# EAGLE board FDT_BIG_Jly21 (EAGLE 7.6.0), part 1 of 3
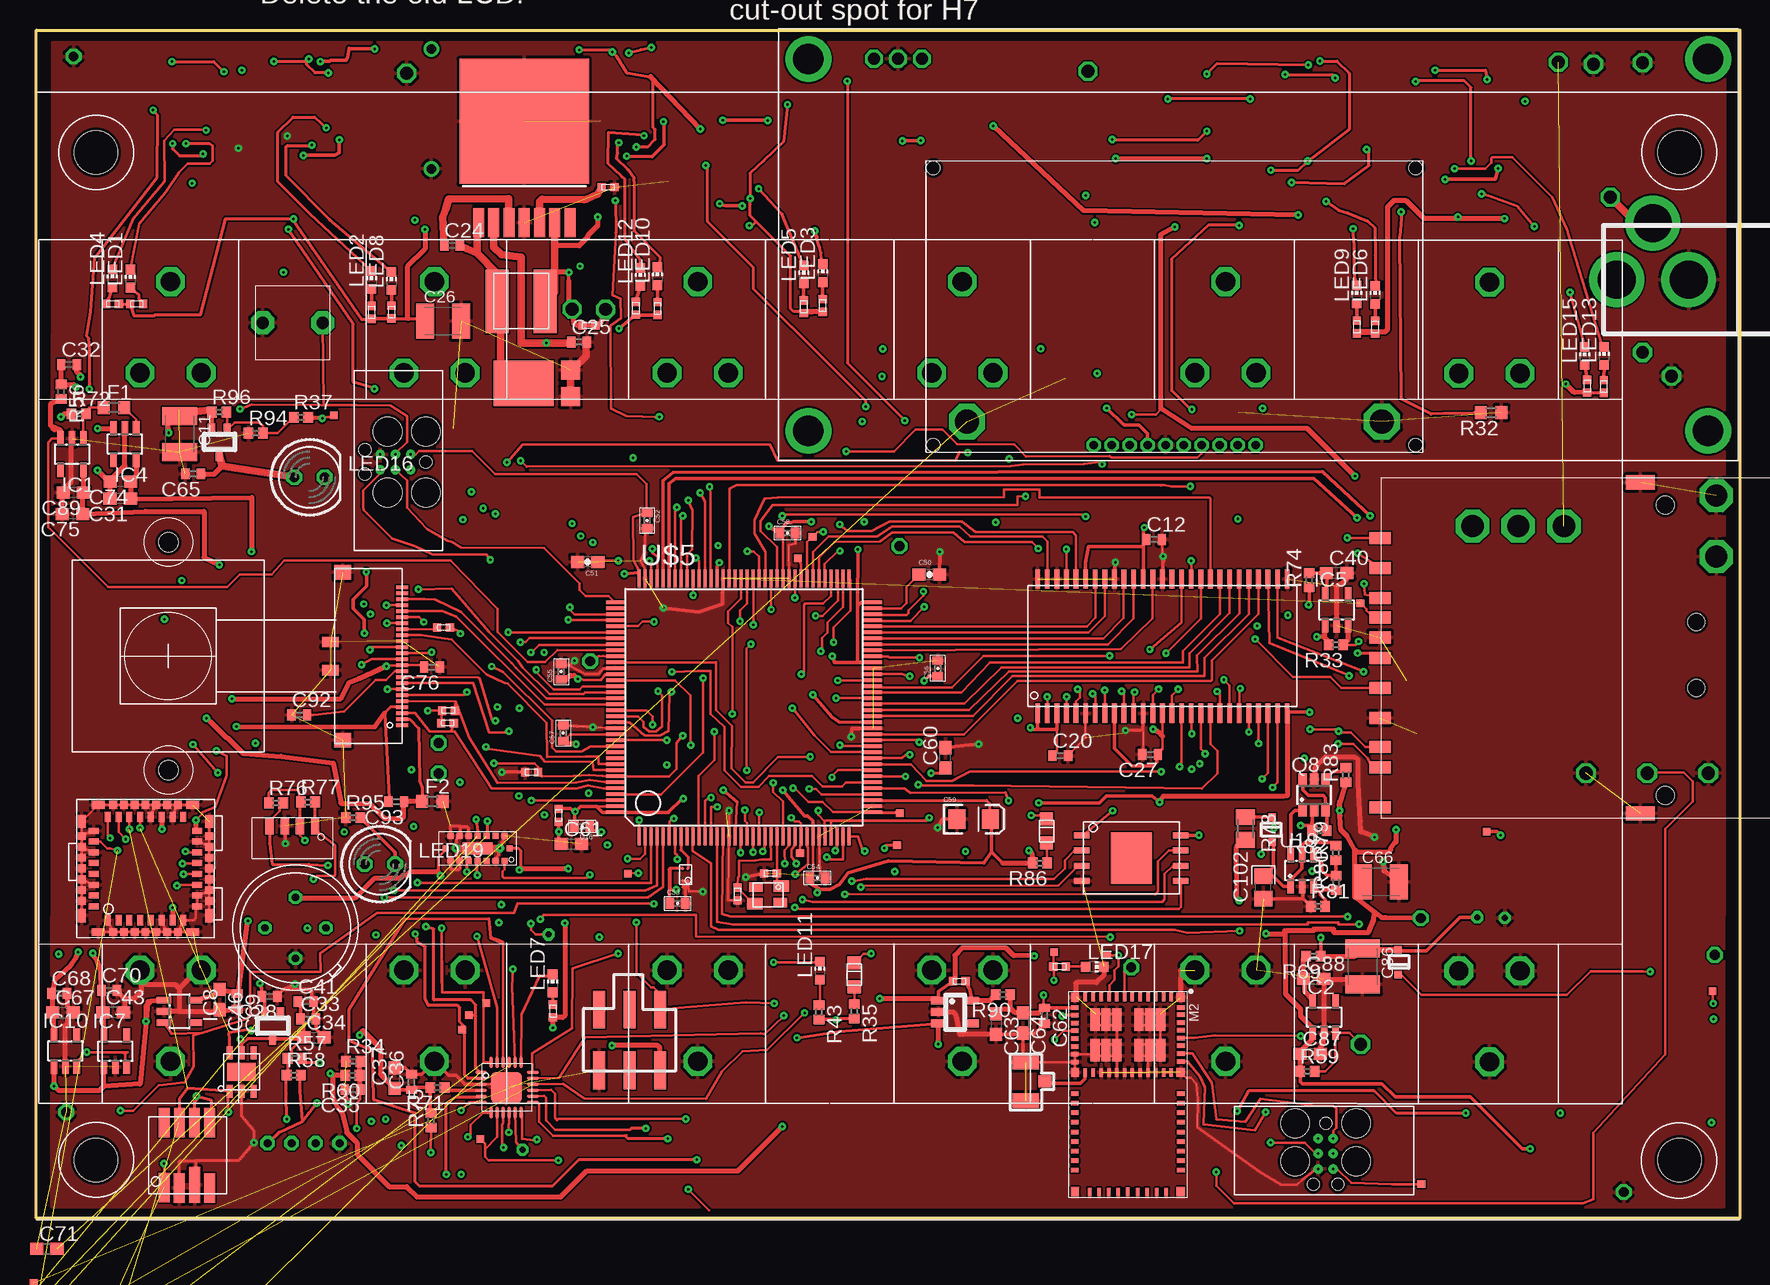
[diagram p7: board, top side]
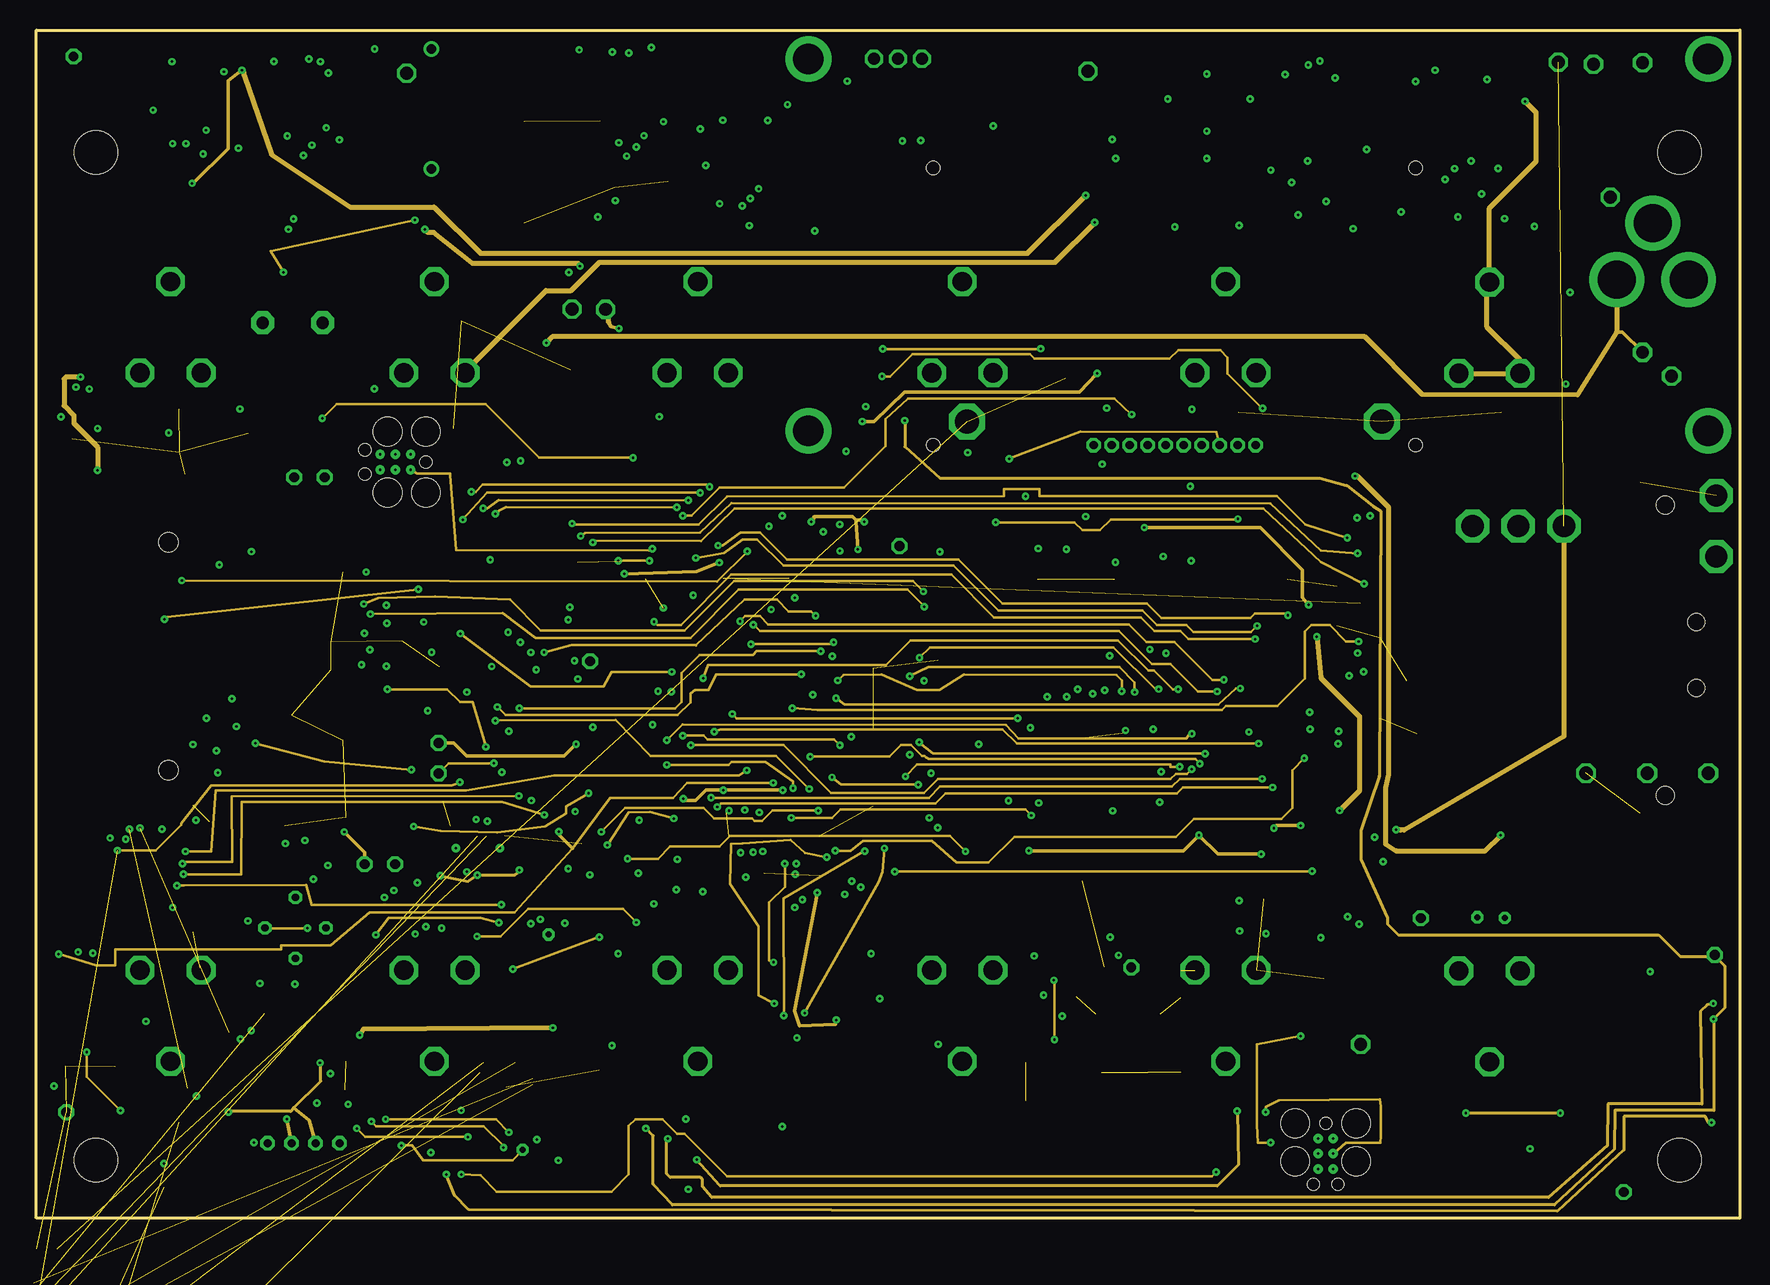
[diagram p8: board, inner layer Route2]
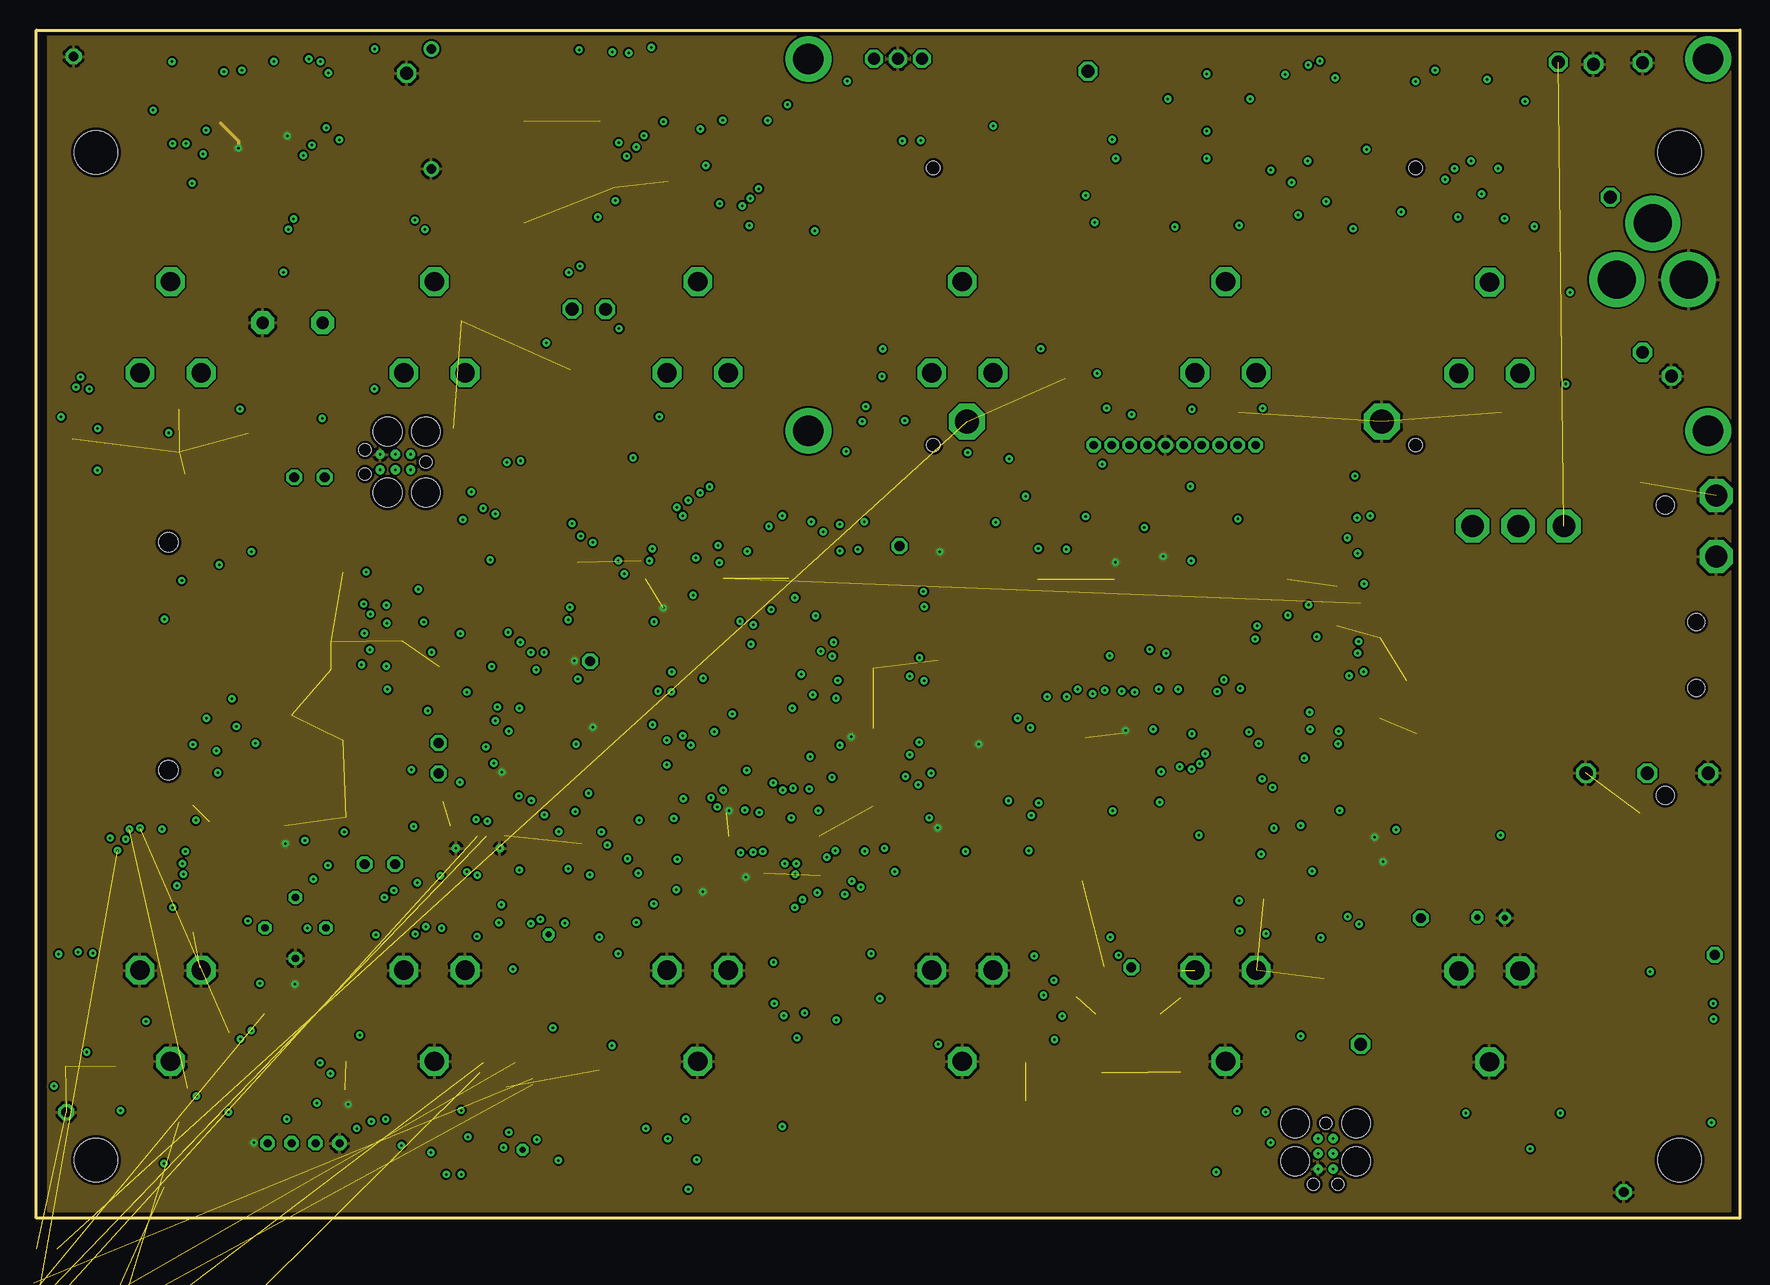
[diagram p9: board, inner layer Route15]
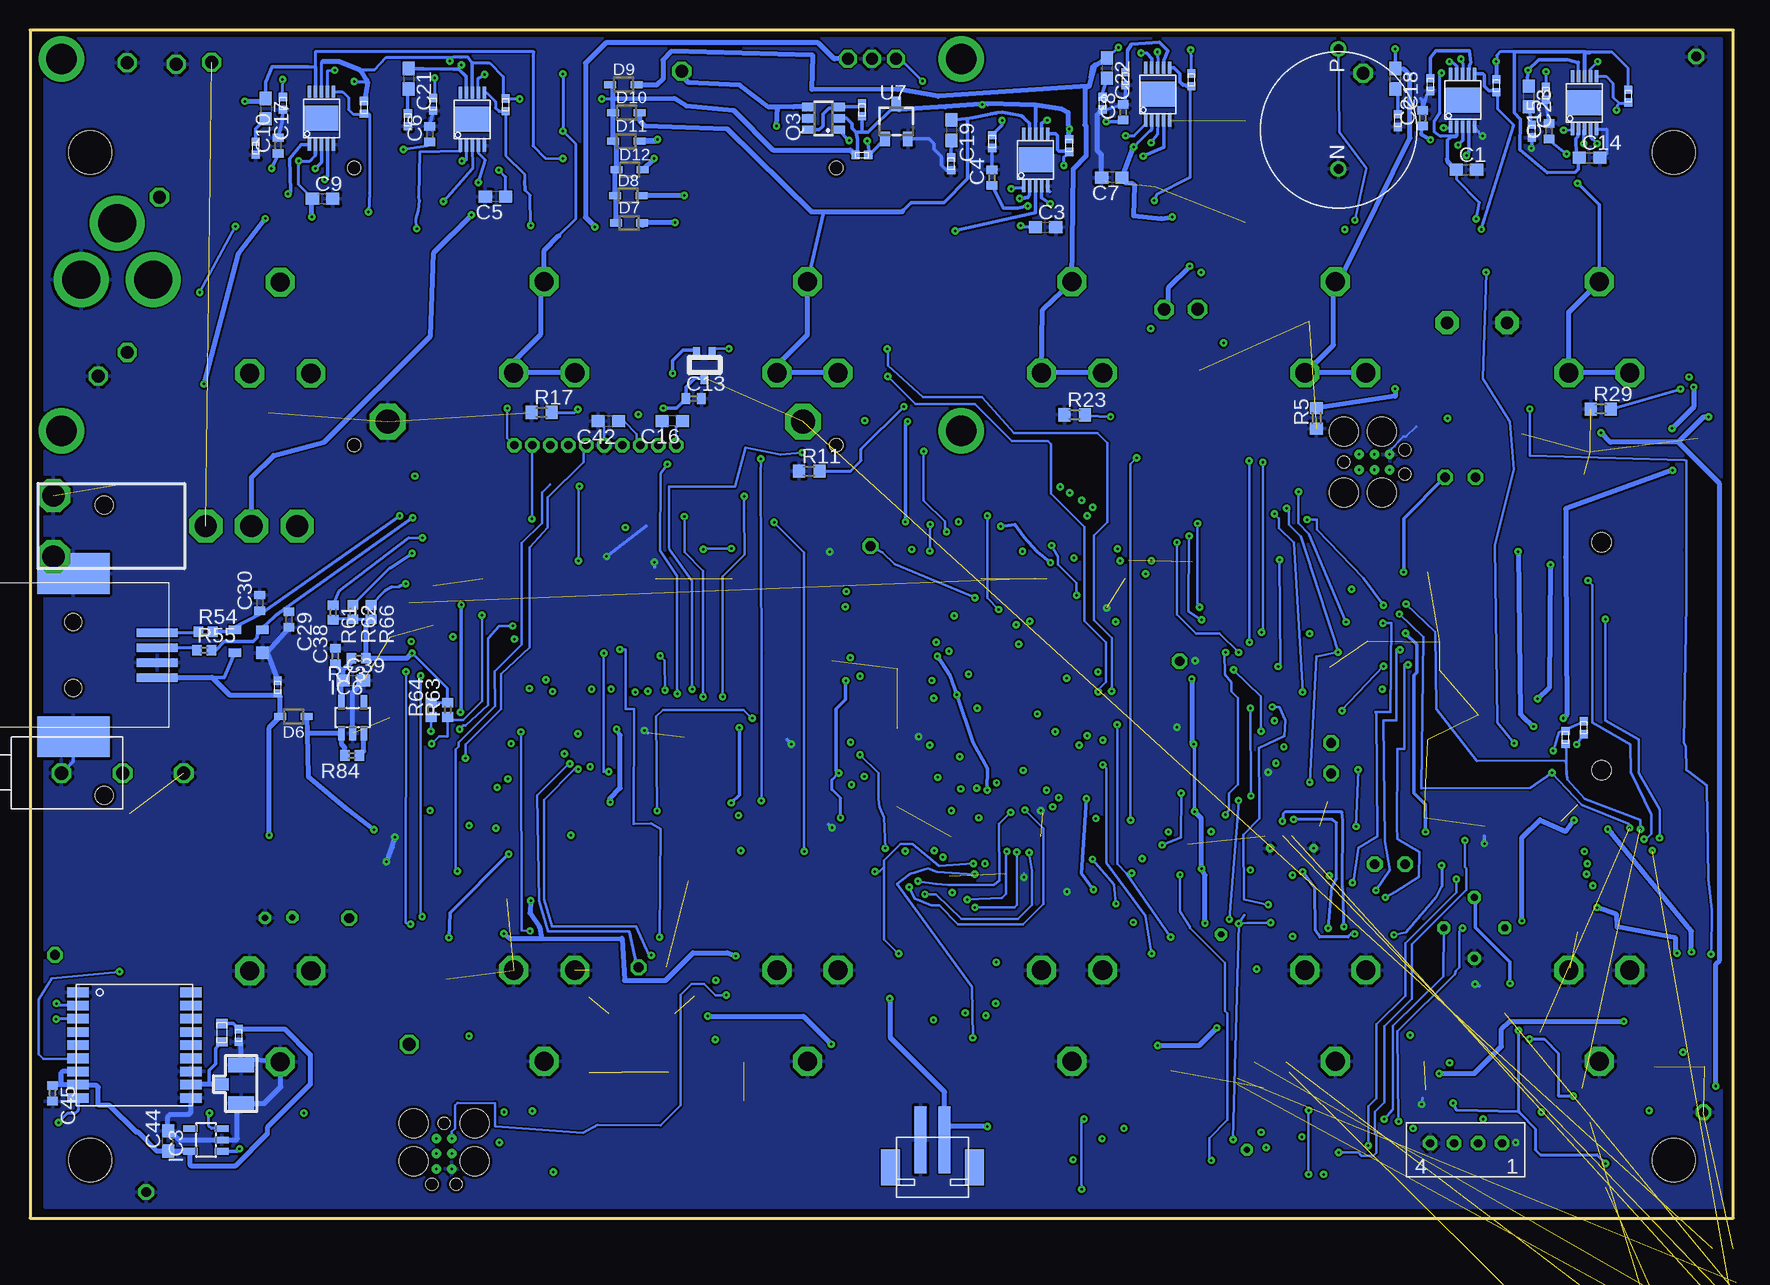
[diagram p10: board, bottom side, seen from below]

Size 141.99 x 99.06 mm. Coordinates in mm from the lower left corner, seen from the top.
Outline: 0,0 0,99.06 141.99,99.06 141.99,0 0,0
Copper layers (1*2*15*16): Top 0.035mm / dielectric 1.5mm / Route2 0.035mm / dielectric 0.15mm / Route15 0.035mm / dielectric 0.2mm / Bottom 0.035mm
Design rules "default *": minimum track width 6mil, minimum drill 8mil, track to track 6mil, track to pad 6mil, pad to pad 6mil, via to via 6mil, smd to smd 6mil, copper to edge 10mil, drill to drill 8mil, minimum pad ring 10mil, minimum via ring 8mil, stop-mask expansion 4mil, vias tented up to drill 0mil, thermal gap 10mil

## Footprints (pad centres in the part's own frame; a part is rotated, then mirrored left to right if it is on the bottom)
BATT_COIN_BR1225 = drill 0.8: NEG 0,0; PLUS 10,0
BATT_HALFX6 = drill 1.6 octagon: 1NA -53.35,-28.19; 1NB -48.25,-28.19; 1NC -50.8,-35.79; 1PA -50.8,29.21; 1PB -53.35,21.61; 1PC -48.25,21.61; 2NA -28.8,-35.79; 2NB -31.35,-28.19; 2NC -26.25,-28.19; 2PA -28.8,29.21; 2PB -31.35,21.61; 2PC -26.25,21.61; 3NA -9.4,-28.19; 3NB -4.3,-28.19; 3NC -6.85,-35.79; 3PA -6.85,29.21; 3PB -9.4,21.61; 3PC -4.3,21.61; 4NA 12.65,-28.19; 4NB 17.75,-28.19; 4NC 15.2,-35.79; 4PA 15.2,29.21; 4PB 12.65,21.61; 4PC 17.75,21.61; 5NA 34.6,-28.19; 5NB 39.7,-28.19; 5NC 37.15,-35.79; 5PA 37.15,29.21; 5PB 34.6,21.61; 5PC 39.7,21.61; 6NA 56.6,-28.24; 6NB 61.7,-28.24; 6NC 59.15,-35.84; 6PA 59.15,29.16; 6PB 56.6,21.56; 6PC 61.7,21.56
ENCL_1554H = hole 3.6: -66,42; 66,42; 66,-42; -66,-42
C0603 = smd 1.1 x 1: 1 -0.85,0; 2 0.85,0
C0402 = smd 0.7 x 0.9: 1 -0.65,0; 2 0.65,0
C1210K = smd 1.5 x 2.9: 1 -1.5,0; 2 1.5,0
SMD_0402 = smd 0.686 x 0.686: P$1 -0.533,0; P$2 0.533,0
0603-CAP = smd 1.1 x 1: 1 -0.85,0; 2 0.85,0
0402-CAP = smd 0.7 x 0.9: 1 -0.65,0; 2 0.65,0
EIA3216 = smd 1.4 x 1.6: A 1.4,0; C -1.4,0
C0805ELEC = smd 1.3 x 1.5: 1P 0.95,0; 2N -0.95,0
DIODE_BIG = smd 1.6 x 1.6: 1_A -1.1,-3.9; 2_A 1.1,-3.9 | smd 3.8 x 5: 3_K 0,0
TVSDIODE = smd 1.05 x 1.05: P$1 0,0 | smd 0.7 x 1.05: P$2 1.92,0; P$3 1.92,2.3; P$4 0,2.3
SOD323 = smd 0.625 x 0.625: A -1.1,0; K 1,0
SOD323' = smd 1 x 0.6: 1_K -1.1,0; 2_A 1.1,0
R0603 = smd 1 x 1.1: 1 -0.85,0; 2 0.85,0
GPS_ANTE = smd 2.2 x 1.2: P$1 0,-1.6; P$2 0,1.6 | smd 1.1 x 1: P$3 1.6,0
IND_CDRH4D = smd 5.3 x 1.9: P$3 0,2; P$4 0,-2
SOT23-5 = smd 0.55 x 1.2: 1 -0.95,-1.3; 2 0,-1.3; 3 0.95,-1.3; 4 0.95,1.3; 5 -0.95,1.3
FLIR_SOCKET = smd 0.5 x 0.84: P$1 -3.15,-4.31; P$2 -2.25,-4.31; P$3 -1.35,-4.31; P$4 -0.45,-4.31; P$5 0.45,-4.31; P$6 1.35,-4.31; P$7 2.25,-4.31; P$8 3.15,-4.31; P$17 3.15,4.31; P$18 2.25,4.31; P$19 1.35,4.31; P$20 0.45,4.31; P$21 -0.45,4.31; P$22 -1.35,4.31; P$23 -2.25,4.31; P$24 -3.15,4.31 | smd 0.84 x 0.5: P$9 4.31,-3.15; P$10 4.31,-2.25; P$11 4.31,-1.35; P$12 4.31,-0.45; P$13 4.31,0.45; P$14 4.31,1.35; P$15 4.31,2.25; P$16 4.31,3.15; P$25 -4.31,3.15; P$26 -4.31,2.25; P$27 -4.31,1.35; P$28 -4.31,0.45; P$29 -4.31,-0.45; P$30 -4.31,-1.35; P$31 -4.31,-2.25; P$32 -4.31,-3.15 | smd 1.1 x 0.65: P$33 -3.93,-5.3; P$41 3.93,-5.3; P$51 3.93,5.3; P$59 -3.93,5.3 | smd 0.65 x 0.65: P$34 -2.7,-5.3; P$35 -1.8,-5.3; P$36 -0.9,-5.3; P$37 0,-5.3; P$38 0.9,-5.3; P$39 1.8,-5.3; P$40 2.7,-5.3; P$43 5.3,-2.7; P$44 5.3,-1.8; P$45 5.3,-0.9; P$46 5.3,0; P$47 5.3,0.9; P$48 5.3,1.8; P$49 5.3,2.7; P$52 2.7,5.3; P$53 1.8,5.3; P$54 0.9,5.3; P$55 0,5.3; P$56 -0.9,5.3; P$57 -1.8,5.3; P$58 -2.7,5.3; P$61 -5.3,2.7; P$62 -5.3,1.8; P$63 -5.3,0.9; P$64 -5.3,0; P$65 -5.3,-0.9; P$66 -5.3,-1.8; P$67 -5.3,-2.7 | smd 0.65 x 1.1: P$42 5.3,-3.93; P$50 5.3,3.93; P$60 -5.3,3.93; P$68 -5.3,-3.93
CONN_FPC_24PIN = smd 0.3 x 1: P1 5.75,0.5; P2 5.25,0.5; P3 4.75,0.5; P4 4.25,0.5; P5 3.75,0.5; P6 3.25,0.5; P7 2.75,0.5; P8 2.25,0.5; P9 1.75,0.5; P10 1.25,0.5; P11 0.75,0.5; P12 0.25,0.5; P13 -0.25,0.5; P14 -0.75,0.5; P15 -1.25,0.5; P16 -1.75,0.5; P17 -2.25,0.5; P18 -2.75,0.5; P19 -3.25,0.5; P20 -3.75,0.5; P21 -4.25,0.5; P22 -4.75,0.5; P23 -5.25,0.5; P24 -5.75,0.5 | smd 0.85 x 1.4: P$25 -1.175,-5.46; P$26 1.175,-5.46 | smd 1.22 x 1.4: P$27 -7,-4.45; P$28 7,-4.45
USB_B_SMT_HORIZ = smd 0.7 x 3.4: 1_VBUS 1.875,7; 2_DM -0.625,7; 3_DP -1.875,7; 4_GND 0.625,7 | smd 3.4 x 6.04: P$1 6.8,0; P$2 -6.8,0 | hole 1.4: -2.75,0; 2.75,0
HDR_SEGGER_6P = drill 0.203 pad 0.787: 1_VREF 1.27,-0.635; 2_DIO 1.27,0.635; 3_RST 2.54,-0.635; 4_CLK 2.54,0.635; 5_GND 3.81,-0.635; 6_SWO 3.81,0.635 | hole 0.991: 0,0; 5.08,-1.016; 5.08,1.016 | hole 2.388: 0,2.54; 0,-2.54; 3.175,2.54; 3.175,-2.54
HDR_PGM_TINY_SMT = smd 3.15 x 1: 1_VCC -2.54,-2.54; 2_RST_PGM 2.54,-2.54; 3__NC -2.54,0; 4__NC 2.54,0; 5__GND -2.54,2.54; 6__NC 2.54,2.54
CONN_4PCABLE = drill 0.7 octagon: P1 6,0; P2 4,0; P3 2,0; P4 0,0
CONN_2PCABLE_SMT = smd 1 x 5.6: P$1 -1,-2.8; P$2 1,-2.8 | smd 1.6 x 3: P$3 -3.5,-0.5; P$4 3.5,-0.5
PWR_JAC4 = drill 3.175 pad 4.572: P$1 0,5.994; P$2 0,0; P$3 4.699,2.997
SMD_IND = smd 0.762 x 0.94: P$1 -0.762,0; P$2 0.762,0
LCD_NHD_3PINS = drill 1 octagon: 1_D -29.5,15.5; 2_VSS -27.5,15.5; 3_VDD -25.5,15.5 | drill 2.54 pad 3.81: P$1 -34.96,-15.5; P$2 -34.96,15.5; P$3 40.04,15.5; P$4 40.04,-15.5
CHIP-LED0603 = smd 0.8 x 0.8: A 0,-0.75; C 0,0.75
LED_RA_SM = smd 1.1 x 1.1: 1_A -1,0; 2_K 1,0
LED5MM = drill 0.813 octagon: A -1.27,0; K 1.27,0
LENS_MOUNT_CMT107 = hole 1.6: -9.5,0; 9.5,0
ISP4520-LGA-QFN74-9.8X17.2X1.7MM = smd 0.7 x 0.7: 1 0.5,9.3; 14 0.5,0.5; 23 6.75,0.5; 36 6.75,9.3; 54 16.7,0.5; 64 16.7,9.3 | smd 0.65 x 0.3: 2 0.475,8.525; 3 0.475,7.875; 4 0.475,7.225; 5 0.475,6.575; 6 0.475,5.925; 7 0.475,5.275; 8 0.475,4.625; 9 0.475,3.975; 10 0.475,3.325; 11 0.475,2.675; 12 0.475,2.025; 13 0.475,1.325; 24 6.775,1.325; 25 6.775,2.025; 26 6.775,2.675; 27 6.775,3.325; 28 6.775,3.975; 29 6.775,4.625; 30 6.775,5.275; 31 6.775,5.925; 32 6.775,6.575; 33 6.775,7.225; 34 6.775,7.875; 35 6.775,8.525; 55 16.73,1.7; 56 16.73,2.5; 57 16.73,3.3; 58 16.73,4.1; 59 16.725,4.9; 60 16.73,5.7; 61 16.73,6.5; 62 16.73,7.3; 63 16.73,8.1 | smd 0.3 x 0.65: 15 1.35,0.475; 16 2,0.475; 17 2.65,0.475; 18 3.3,0.475; 19 3.95,0.475; 20 4.6,0.475; 21 5.25,0.475; 22 5.9,0.475; 37 5.85,9.325; 38 5.2,9.325; 39 4.55,9.325; 40 3.9,9.325; 41 3.25,9.325; 42 2.6,9.325; 43 1.95,9.325; 44 1.35,9.325; 45 8.525,0.475; 46 9.325,0.475; 47 10.125,0.475; 48 10.925,0.475; 49 11.725,0.475; 50 12.525,0.475; 51 13.325,0.475; 52 14.125,0.475; 53 14.925,0.475; 65 14.925,9.325; 66 14.125,9.325; 67 13.325,9.325; 68 12.525,9.325; 69 11.725,9.325; 70 10.925,9.325; 71 10.125,9.325; 72 9.325,9.325; 73 8.525,9.325 | smd 0.85 x 0.8: 74 1.88,5.825; 75 4.425,5.825; 76 1.88,2.175; 77 4.425,2.175; 78 1.88,6.725; 79 1.88,7.625; 80 2.83,5.825; 81 2.83,6.725; 82 2.83,7.625; 83 4.43,6.725; 84 4.43,7.625; 85 5.38,5.825; 86 5.38,6.725; 87 5.38,7.625; 88 1.88,3.075; 89 1.88,3.975; 90 2.83,2.175; 91 2.83,3.075; 92 2.83,3.975; 93 4.43,3.075; 94 4.43,3.975; 95 5.38,2.175; 96 5.38,3.075; 97 5.38,3.975
PIR_4P = drill 0.61 pad 0.864 octagon: DL 2.54,0; SI -2.54,0; VDD 0,2.54; VSS 0,-2.54
SOT23_PFET = smd 0.6 x 1: 1_G 0.65,0.83; 2_S -0.65,0.83; 3_D 0,-1.27
SSOT6 = smd 0.69 x 0.99: 1 -0.95,-1.3; 2 0,-1.3; 3 0.95,-1.3; 4 0.95,1.3; 5 0,1.3; 6 -0.95,1.3
R0402 = smd 0.8 x 0.9: 1 -0.6,0; 2 0.6,0
M0805 = smd 1.3 x 1.6: 1 -0.95,0; 2 0.95,0
SD_CARD = smd 1 x 1.8: CD 2.725,0; P1 6.875,0; P2 4.375,0; P3 1.075,0; P4 -0.625,0; P5 -3.125,0; P6 -5.625,0; P7 -8.05,0; P8 -9.75,0; P9 9.375,0; WP -13.1,0 | smd 1.2 x 2.4: P$12 -13.6,-21.7; P$13 14,-21.7 | hole 1.5: -12.1,-23.8; 12.1,-23.8
SW_SQ = drill 1.016 pad 1.93 octagon: P$1 -2.5,0; P$2 2.5,0
SW_TOG_RA = drill 1.854 octagon: P$1 0,0; P$2 3.81,0; P$3 7.62,0; P$4 -12.7,2.54; P$5 -12.7,-2.54
SW_PBUTTON_RA = drill 1.1 octagon: 1_SW 0,0; 2_SW -5.1,0; 3_SHIELD 5.1,0
TESTP_SM = drill 0.813 pad 1.321 octagon: P$1 0,0
TP_THSM2 = drill 1.067 pad 1.524 octagon: P$1 0,0
TP_SMT = smd 0.635 x 0.635: P$1 0,0
TP_THSM = drill 0.508 octagon: P$1 0,0
LTC4053 = smd 0.29 x 1: P$1 -1,-2.2; P$2 -0.5,-2.2; P$3 0,-2.2; P$4 0.5,-2.2; P$5 1,-2.2; P$6 1,2.2; P$7 0.5,2.2; P$8 0,2.2; P$9 -0.5,2.2; P$10 -1,2.2 | smd 2.8 x 2.08: P$11 0,0
HUMIDITY_A = smd 0.5 x 1.1: P$1 -1,-1.6; P$2 0,-1.6; P$3 1,-1.6; P$4 1,1.6; P$5 0,1.6; P$6 -1,1.6 | smd 2.4 x 1.5: P$7 0,0
TO236 = smd 0.8 x 1.2: 1 -0.95,-1.45; 2 0.95,-1.45; 3 0,1.45
FLIGHT_SENSE_L5 = smd 0.5 x 0.5: A1 2.25,-1.05; A2 1.5,-1.05; A3 0.75,-1.05; A4 0,-1.05; A5 -0.75,-1.05; A6 -1.5,-1.05; A7 -2.25,-1.05; B1 2.65,0; B7 -2.65,0; C1 2.25,1.05; C2 1.5,1.05; C3 0.75,1.05; C4 0,1.05; C5 -0.75,1.05; C6 -1.5,1.05; C7 -2.25,1.05 | drill 0.203 pad 0.457: B2 1.85,0; B3 -1.8,0 | smd 2.5 x 1: B4 0,0
TO263-7 = smd 0.914 x 2.413: 1 -3.81,-8.458; 2 -2.54,-8.458; 3 -1.27,-8.458; 4 0,-8.458; 5 1.27,-8.458; 6 2.54,-8.458; 7 3.81,-8.458 | smd 10.8 x 10.41: 8 0,0
TSOP_54 = smd 0.4 x 1.6: P$1 -9.3,-5.6; P$2 -8.5,-5.6; P$3 -7.7,-5.6; P$4 -6.9,-5.6; P$5 -6.1,-5.6; P$6 -5.3,-5.6; P$7 -4.5,-5.6; P$8 -3.7,-5.6; P$9 -2.9,-5.6; P$10 -2.1,-5.6; P$11 -1.3,-5.6; P$12 -0.5,-5.6; P$13 0.3,-5.6; P$14 1.1,-5.6; P$15 1.9,-5.6; P$16 2.7,-5.6; P$17 3.5,-5.6; P$18 4.3,-5.6; P$19 5.1,-5.6; P$20 5.9,-5.6; P$21 6.7,-5.6; P$22 7.5,-5.6; P$23 8.3,-5.6; P$24 9.1,-5.6; P$25 9.9,-5.6; P$26 10.7,-5.6; P$27 11.5,-5.6; P$28 11.5,5.6; P$29 10.7,5.6; P$30 9.9,5.6; P$31 9.1,5.6; P$32 8.3,5.6; P$33 7.5,5.6; P$34 6.7,5.6; P$35 5.9,5.6; P$36 5.1,5.6; P$37 4.3,5.6; P$38 3.5,5.6; P$39 2.7,5.6; P$40 1.9,5.6; P$41 1.1,5.6; P$42 0.3,5.6; P$43 -0.5,5.6; P$44 -1.3,5.6; P$45 -2.1,5.6; P$46 -2.9,5.6; P$47 -3.7,5.6; P$48 -4.5,5.6; P$49 -5.3,5.6; P$50 -6.1,5.6; P$51 -6.9,5.6; P$52 -7.7,5.6; P$53 -8.5,5.6; P$54 -9.3,5.6
ALS = smd 0.7 x 1.4: P$1 -1.9,0; P$2 -0.635,0; P$3 0.635,0; P$4 1.9,0
UBLOX_M8 = smd 1.8 x 0.8: P$1 -4.7,4.4; P$2 -4.7,3.3; P$3 -4.7,2.2; P$4 -4.7,1.1; P$5 -4.7,0; P$6 -4.7,-1.1; P$7 -4.7,-2.2; P$8 -4.7,-3.3; P$9 -4.7,-4.4; P$10 4.7,-4.4; P$11 4.7,-3.3; P$12 4.7,-2.2; P$13 4.7,-1.1; P$14 4.7,0; P$15 4.7,1.1; P$16 4.7,2.2; P$17 4.7,3.3; P$18 4.7,4.4
WSON_8 = smd 1.27 x 0.508: 1_CS -4.128,1.905; 2_DP -4.128,0.635; 3_WP -4.128,-0.635; 4_GND -4.128,-1.905; 5_DI 4.128,-1.905; 6_CL 4.128,-0.635; 7_RST 4.128,0.635; 8_VCC 4.128,1.905 | smd 3.404 x 4.293: P$9 0,0
SOT_235B = smd 0.65 x 1.2: P$1 -0.95,-1.4; P$2 0,-1.4; P$3 0.95,-1.4; P$4 0.95,1.4; P$5 -0.95,1.4
SOT23-6L = smd 0.55 x 1.2: 1 -0.95,-1.3; 2 0,-1.3; 3 0.95,-1.3; 4 0.95,1.3; 5 0,1.3; 6 -0.95,1.3
ALTIMETER_TEC = smd 0.9 x 2.45: P$1 -1.9,-2.7; P$2 -0.65,-2.725; P$4 1.9,-2.725; P$5 1.9,2.725; P$6 0.625,2.725; P$7 -0.625,2.725; P$8 -1.9,2.725 | smd 0.9 x 3: P$3 0.65,-2.475
QFN24 = smd 1 x 0.3: P$1 -2.1,1.25; P$2 -2.1,0.75; P$3 -2.1,0.25; P$4 -2.1,-0.25; P$5 -2.1,-0.75; P$6 -2.1,-1.25; P$13 2.2,-1.25; P$14 2.2,-0.75; P$15 2.2,-0.25; P$16 2.2,0.25; P$17 2.2,0.75; P$18 2.2,1.25 | smd 0.3 x 1: P$7 -1.25,-2.1; P$8 -0.75,-2.1; P$9 -0.25,-2.1; P$10 0.25,-2.1; P$11 0.75,-2.1; P$12 1.25,-2.1; P$19 1.25,2.1; P$20 0.75,2.1; P$21 0.25,2.1; P$22 -0.25,2.1; P$23 -0.75,2.1; P$24 -1.25,2.1 | smd 2.6 x 2.6: P$25 0,0
LCD_3V_SMALL = drill 0.7 pad 1.2 octagon: P$1 27.45,0.6; P$2 25.95,0.6; P$3 24.45,0.6; P$4 22.95,0.6; P$5 21.45,0.6; P$6 19.95,0.6; P$7 18.45,0.6; P$8 16.95,0.6; P$9 15.45,0.6; P$10 13.95,0.6 | drill 2 pad 2.8 octagon: P$11 3.4,2.55; P$12 38,2.55 | hole 1.1: 0.6,23.7; 0.6,0.6; 40.8,23.7; 40.8,0.6
LQFP144@1 = smd 0.27 x 1.5: 1 -8.75,-10.75; 2 -8.25,-10.75; 3 -7.75,-10.75; 4 -7.25,-10.75; 5 -6.75,-10.75; 6 -6.25,-10.75; 7 -5.75,-10.75; 8 -5.25,-10.75; 9 -4.75,-10.75; 10 -4.25,-10.75; 11 -3.75,-10.75; 12 -3.25,-10.75; 13 -2.75,-10.75; 14 -2.25,-10.75; 15 -1.75,-10.75; 16 -1.25,-10.75; 17 -0.75,-10.75; 18 -0.25,-10.75; 19 0.25,-10.75; 20 0.75,-10.75; 21 1.25,-10.75; 22 1.75,-10.75; 23 2.25,-10.75; 24 2.75,-10.75; 25 3.25,-10.75; 26 3.75,-10.75; 27 4.25,-10.75; 28 4.75,-10.75; 29 5.25,-10.75; 30 5.75,-10.75; 31 6.25,-10.75; 32 6.75,-10.75; 33 7.25,-10.75; 34 7.75,-10.75; 35 8.25,-10.75; 36 8.75,-10.75; 73 8.75,10.75; 74 8.25,10.75; 75 7.75,10.75; 76 7.25,10.75; 77 6.75,10.75; 78 6.25,10.75; 79 5.75,10.75; 80 5.25,10.75; 81 4.75,10.75; 82 4.25,10.75; 83 3.75,10.75; 84 3.25,10.75; 85 2.75,10.75; 86 2.25,10.75; 87 1.75,10.75; 88 1.25,10.75; 89 0.75,10.75; 90 0.25,10.75; 91 -0.25,10.75; 92 -0.75,10.75; 93 -1.25,10.75; 94 -1.75,10.75; 95 -2.25,10.75; 96 -2.75,10.75; 97 -3.25,10.75; 98 -3.75,10.75; 99 -4.25,10.75; 100 -4.75,10.75; 101 -5.25,10.75; 102 -5.75,10.75; 103 -6.25,10.75; 104 -6.75,10.75; 105 -7.25,10.75; 106 -7.75,10.75; 107 -8.25,10.75; 108 -8.75,10.75 | smd 1.5 x 0.27: 37 10.75,-8.75; 38 10.75,-8.25; 39 10.75,-7.75; 40 10.75,-7.25; 41 10.75,-6.75; 42 10.75,-6.25; 43 10.75,-5.75; 44 10.75,-5.25; 45 10.75,-4.75; 46 10.75,-4.25; 47 10.75,-3.75; 48 10.75,-3.25; 49 10.75,-2.75; 50 10.75,-2.25; 51 10.75,-1.75; 52 10.75,-1.25; 53 10.75,-0.75; 54 10.75,-0.25; 55 10.75,0.25; 56 10.75,0.75; 57 10.75,1.25; 58 10.75,1.75; 59 10.75,2.25; 60 10.75,2.75; 61 10.75,3.25; 62 10.75,3.75; 63 10.75,4.25; 64 10.75,4.75; 65 10.75,5.25; 66 10.75,5.75; 67 10.75,6.25; 68 10.75,6.75; 69 10.75,7.25; 70 10.75,7.75; 71 10.75,8.25; 72 10.75,8.75; 109 -10.75,8.75; 110 -10.75,8.25; 111 -10.75,7.75; 112 -10.75,7.25; 113 -10.75,6.75; 114 -10.75,6.25; 115 -10.75,5.75; 116 -10.75,5.25; 117 -10.75,4.75; 118 -10.75,4.25; 119 -10.75,3.75; 120 -10.75,3.25; 121 -10.75,2.75; 122 -10.75,2.25; 123 -10.75,1.75; 124 -10.75,1.25; 125 -10.75,0.75; 126 -10.75,0.25; 127 -10.75,-0.25; 128 -10.75,-0.75; 129 -10.75,-1.25; 130 -10.75,-1.75; 131 -10.75,-2.25; 132 -10.75,-2.75; 133 -10.75,-3.25; 134 -10.75,-3.75; 135 -10.75,-4.25; 136 -10.75,-4.75; 137 -10.75,-5.25; 138 -10.75,-5.75; 139 -10.75,-6.25; 140 -10.75,-6.75; 141 -10.75,-7.25; 142 -10.75,-7.75; 143 -10.75,-8.25; 144 -10.75,-8.75
XTAL_SMALL = smd 1.3 x 0.95: P$1 -1.1,-0.725; P$3 1.1,0.725 | smd 1.15 x 0.8: P$2 1.025,-0.65; P$4 -1.025,0.65
TCXO_32K_BGA = smd 0.25 x 0.25: P$1 -0.5,-0.205; P$2 0.5,-0.205; P$3 0.5,0.205; P$4 -0.5,0.205

## Placement (x,y rotation side)
B2  BATT_COIN_BR1225  [BATT_COIN_BR1225]  32.92,87.48 90 bottom
BATT1  BATT_6X18650  [BATT_HALFX6]  61.98,48.87 0 top
BOX1  ENCL_1554H  [ENCL_1554H]  70.97,46.86 0 top
C1  4.7uF  [C0603]  22.25,87.41 0 bottom
C2  0.1uF  [C0402]  25.91,91.71 90 bottom
C3  4.7uF  [C0603]  57.33,82.62 0 bottom
C4  0.1uF  [C0402]  61.8,86.76 90 bottom
C5  4.7uF  [C0603]  103.18,85.17 180 bottom
C6  0.1uF  [C0402]  108.66,90.37 90 bottom
C7  4.7uF  [C0603]  51.81,86.77 180 bottom
C8  0.1uF  [C0402]  50.87,92.2 90 bottom
C9  4.7uF  [C0603]  117.6,84.99 0 bottom
C10  0.1uF  [C0402]  121.31,89.43 90 bottom
C11  220uF  [C1210K]  11.94,65.38 270 top
C12  0.1uF  [C0402]  93.17,56.59 0 top
C13  0.1uF  [C0402]  86.66,68.33 0 bottom
C14  4.7uF  [C0603]  11.99,88.42 0 bottom
C15  0.1uF  [C0402]  15.37,90.63 90 bottom
C16  1uF  [C0603]  88.44,66.47 180 bottom
C17  1uF  [C0603]  122.33,92.51 270 bottom
C18  1uF  [C0603]  28.19,95 270 bottom
C19  1uF  [C0603]  65.18,90.7 270 bottom
C20  0.1uF  [C0402]  85.34,38.56 0 top
C21  1uF  [C0603]  110.44,95 270 bottom
C22  1uF  [C0603]  52.22,95.89 270 bottom
C23  1uF  [C0603]  17.07,93.52 270 bottom
C24  0.1uF  [C0402]  34.65,81.1 0 top
C25  0.47uF  [C0402]  45.24,73.05 0 top
C26  [C1210K]  33.88,74.78 0 top
C27  0.1uF  [C0402]  92.84,38.66 180 top
C28  0.1uF  [C0402]  19.43,18.49 180 top
C29  47pF  [C0402]  120.4,49.91 270 bottom
C30  47pF  [C0402]  122.83,51.31 90 bottom
C31  10uF  [C0603]  6.99,59.99 180 top
C32  0.1uF  [C0402]  2.72,71.17 0 top
C33  0.1uF  [C0402]  22.66,16.61 0 top
C34  1.0uF  [C0603]  23.14,15.06 0 top
C35  0.1uF  [C0402]  26.34,10.72 180 top
C36  0.1uF  [C0402]  31.27,11.35 90 top
C37  10uF  [C0603]  29.84,11.68 90 top
C38  0.1uF  [C0402]  116.54,46.86 90 bottom
C39  10uF  [C0603]  115.04,44.83 0 bottom
C40  10uF  [C0603]  108.38,53.8 0 top
C41  0.1uF  [C0402]  22.45,18.06 0 top
C42  1uF  [C0603]  93.78,66.45 180 bottom
C43  4.7uF  [C0603]  6.4,17.17 0 top
C44  10uF  [C0603]  130.48,6.45 90 bottom
C45  0.1uF  [C0402]  140.11,10.41 270 bottom
C46  4.7uF  [C0603]  15.29,18.24 270 top
C47  18pF  [SMD_0402]  124.59,15.24 90 bottom
C48  10pF  [SMD_0402]  61.19,28.75 180 top
C49  10pF  [SMD_0402]  58.45,27.03 270 top
C50  2.2uF  [0603-CAP]  74.42,53.67 0 top
C51  2.2uF  [0603-CAP]  45.95,54.71 180 top
C52  0.1uF  [0402-CAP]  50.9,58.17 270 top
C53  0.1uF  [0402-CAP]  53.44,26.24 0 top
C54  0.1uF  [0402-CAP]  65.1,28.37 0 top
C55  0.1uF  [0402-CAP]  43.74,45.57 90 top
C56  0.1uF  [0402-CAP]  75.13,45.85 90 top
C57  0.1uF  [0402-CAP]  43.92,40.44 90 top
C58  0.1uF  [0402-CAP]  62.61,57.12 0 top
C59  100uF  [EIA3216]  78.13,33.27 0 top
C60  1.0uF  [C0603]  75.77,38.38 90 top
C61  1.0uF  [C0603]  44.6,31.19 0 top
C62  0.1uF  [C0402]  84.02,16.89 270 top
C63  1.0uF  [C0603]  79.98,16.18 270 top
C64  10uF  [C0603]  82.25,16.28 270 top
C65  0.1uF  [C0402]  13.06,62.05 180 top
C66  DNS_220uF_flash  [C1210K]  112.06,28.04 0 top
C67  4.7uF  [C0603]  2.21,17.14 0 top
C68  0.1uF  [C0402]  1.91,18.75 0 top
C69  0.1uF  [C0402]  16.74,18.08 270 top
C70  0.1uF  [C0402]  6.07,19 0 top
C71  2.2uF  [C0603]  0.86,-2.54 0 top
C74  1uF  [C0603]  7.01,61.42 180 top
C75  1uF  [C0603]  3,58.72 180 top
C76  0.1uF  [C0402]  32.97,45.95 180 top
C86  220uF  [C1210K]  110.54,20.98 270 top
C87  10uF  [C0603]  106.17,13.72 0 top
C88  10uF  [C0603]  106.45,19.96 0 top
C89  10uF  [C0603]  3.07,60.5 180 top
C92  0.1uF  [C0402]  21.92,41.96 0 top
C93  0.1uF  [C0402]  30,34.72 180 top
C102  10uF  [C0805ELEC]  102.26,27.58 90 top
C155  10nF  [SMD_0402]  121.34,44.27 90 bottom
D2  DIODE_BIG  [DIODE_BIG]  40.61,69.6 90 top
D3  ESD_SM  [TVSDIODE]  122.61,47.14 90 bottom
D4  DIO_SCH  [SOD323]  113.49,21.31 270 top
D5  DIO_SCH  [SOD323]  103.02,32.44 90 top
D6  DIODE_SCHTKY  [SOD323']  120.02,41.83 180 bottom
D7  DIODE_SCHTKY  [SOD323']  92.05,82.98 0 bottom
D8  DIODE_SCHTKY  [SOD323']  92.13,85.24 0 bottom
D9  DIODE_SCHTKY  [SOD323']  92.52,94.5 0 bottom
D10  DIODE_SCHTKY  [SOD323']  92.26,92.17 0 bottom
D11  DIODE_SCHTKY  [SOD323']  92.29,89.79 0 bottom
D12  DIODE_SCHTKY  [SOD323']  92.01,87.4 0 bottom
F1  [R0603]  6.48,67.59 0 top
F2  [R0603]  32.99,34.75 0 top
G1  GPS_ANT  [GPS_ANTE]  82.47,11.4 0 top
G2  GPS_ANT  [GPS_ANTE]  124.38,11.18 180 bottom
I1  IND_CDRH4  [IND_CDRH4D]  40.41,76.43 270 top
IC1  3.0  [SOT23-5]  2.97,63.7 180 top
IC2  3.3  [SOT23-5]  107.34,16.76 0 top
IC3  3.3  [SOT23-5]  127.3,6.53 90 bottom
IC4  2.8  [SOT23-5]  7.37,64.54 180 top
IC5  3.3  [SOT23-5]  108.38,50.72 0 top
IC6  3.3  [SOT23-5]  115.09,41.73 0 bottom
IC7  1.2  [SOT23-5]  6.58,13.92 0 top
IC8  3.1  [SOT23-5]  11.94,17.25 270 top
IC10  2.8  [SOT23-5]  2.41,13.94 0 top
IR1  FLIR_LEPTOP_SOCKET  [FLIR_SOCKET]  9.09,29.16 0 top
J2  CONN_FPC_24P  [CONN_FPC_24PIN]  29.97,46.86 270 top
J3  USB_B_SMT_HORIZ  [USB_B_SMT_HORIZ]  138.38,46.94 270 bottom
J4  HDR_SEGER_6P  [HDR_SEGGER_6P]  32.46,63.04 180 top
J5  HDR_PGM_TINY_SMT  [HDR_PGM_TINY_SMT]  49.43,14.86 90 top
J6  CONN_4PCABLE_VERT  [CONN_4PCABLE]  25.27,6.25 0 bottom
J7  CONN_2PCABLE_SMT  [CONN_2PCABLE_SMT]  66.75,3.73 180 bottom
J8  HDR_SEGER_6P  [HDR_SEGGER_6P]  107.47,7.92 270 top
J9  [PWR_JAC4]  137.72,78.26 90 top
L5  100nH  [SMD_IND]  125.98,15.47 270 bottom
LCD1  LCD_NHD_3PIN  [LCD_NHD_3PINS]  99.31,81.15 0 top
LED1  RED  [CHIP-LED0603]  7.82,78.33 0 top
LED2  GRN  [CHIP-LED0603]  27.94,78.22 0 top
LED3  RED  [CHIP-LED0603]  65.54,78.79 0 top
LED4  GRN  [CHIP-LED0603]  6.32,78.36 0 top
LED5  GRN  [CHIP-LED0603]  63.96,78.68 0 top
LED6  RED  [CHIP-LED0603]  111.59,76.98 0 top
LED7  [CHIP-LED0603]  43.03,19.58 0 top
LED8  RED  [CHIP-LED0603]  29.59,78.14 0 top
LED9  GRN  [CHIP-LED0603]  110.06,77 0 top
LED10  RED  [CHIP-LED0603]  51.77,78.54 0 top
LED11  RED  [CHIP-LED0603]  65.3,20.65 0 top
LED12  GRN  [CHIP-LED0603]  50.34,78.49 0 top
LED13  RED  [CHIP-LED0603]  130.68,71.91 0 top
LED14  GREEN  [LED_RA_SM]  84.2,32.28 90 top
LED15  GRN  [CHIP-LED0603]  129.06,71.88 0 top
LED16  [LED5MM]  22.76,61.77 0 top
LED17  RED  [CHIP-LED0603]  88.21,20.95 270 top
LED18  BLUE  [LED_RA_SM]  68.17,20.29 90 top
LED19  [LED5MM]  28.63,29.51 0 top
LM2  LENS_MOUNT_CMT107  [LENS_MOUNT_CMT107]  11,46.86 90 top
M2  ISP4520US  [ISP4520-LGA-QFN74-9.8X17.2X1.7MM]  86.08,18.92 270 top
PIR2  PIR_DUAL_4P  [PIR_4P]  21.59,24.21 0 top
Q1  MOSFET_P  [SOT23_PFET]  15.24,64.9 0 top
Q2  MOSFET_P  [SOT23_PFET]  85.78,71.3 0 bottom
Q3  FET_PAIR  [SSOT6]  75.85,91.7 90 bottom
Q5  MOSFET_P  [SOT23_PFET]  19.68,16.23 0 top
Q8  FET_PAIR  [SSOT6]  106.5,35.28 0 top
R1  2K  [SMD_0402]  25.25,94.51 270 bottom
R2  2K  [SMD_0402]  15.62,93.78 270 bottom
R3  1K  [SMD_0402]  27.94,75.52 90 top
R4  4k  [SMD_0402]  19.75,94.41 270 bottom
R5  NTC_10K  [R0603]  34.75,66.7 90 bottom
R6  2K  [SMD_0402]  61.78,89.76 270 bottom
R7  1K  [SMD_0402]  65.54,76.09 90 top
R8  1K  [SMD_0402]  8.36,76.23 0 top
R9  1K  [SMD_0402]  63.96,75.98 90 top
R10  4k  [SMD_0402]  55.36,89.43 270 bottom
R11  NTC_10K  [R0603]  77.04,62.28 0 bottom
R12  2K  [SMD_0402]  108.39,92.87 270 bottom
R13  1K  [SMD_0402]  111.59,74.28 90 top
R14  1K  [SMD_0402]  6.35,76.23 180 top
R15  1K  [SMD_0402]  110.06,74.3 90 top
R16  4k  [SMD_0402]  102.33,92.82 270 bottom
R17  NTC_10K  [R0603]  99.34,67.18 0 bottom
R18  2K  [SMD_0402]  50.67,95 270 bottom
R19  1K  [SMD_0402]  51.77,75.84 90 top
R20  4k  [SMD_0402]  8.76,93.55 270 bottom
R21  1K  [SMD_0402]  49.96,75.87 90 top
R22  4k  [SMD_0402]  45.17,94.9 270 bottom
R23  NTC_10K  [R0603]  54.91,66.98 0 bottom
R24  0  [SMD_0402]  46.05,74.41 180 top
R25  1M  [SMD_0402]  72.62,92.4 90 bottom
R26  1M  [SMD_0402]  72.65,88.64 0 bottom
R27  2K  [SMD_0402]  120.9,92.94 270 bottom
R28  1K  [SMD_0402]  130.66,69.34 90 top
R29  NTC_10K  [R0603]  11.05,67.46 0 bottom
R30  1K  [SMD_0402]  129.26,69.37 90 top
R31  4k  [SMD_0402]  114.15,92.61 270 bottom
R32  NTC_10K  [R0603]  121.26,67.16 180 top
R33  10K  [R0402]  108.31,47.8 180 top
R34  2.2M  [R0402]  26.39,13.08 0 top
R35  330  [R0402]  68.17,17.25 270 top
R36  2.7K  [SMD_0402]  34.26,41.27 0 top
R37  220  [R0402]  22.05,66.78 0 top
R38  2.7K  [SMD_0402]  -0.25,-6.86 0 top  (outside the outline)
R39  2.7K  [SMD_0402]  -0.28,-8.33 0 top  (outside the outline)
R40  2.7K  [SMD_0402]  34.34,42.32 0 top
R41  27  [SMD_0402]  33.93,49.25 0 top
R42  330  [SMD_0402]  43.05,17.27 90 top
R43  330  [R0402]  65.23,17.17 270 top
R44  2.7K  [SMD_0402]  -0.3,-9.8 0 top  (outside the outline)
R45  2.7K  [SMD_0402]  -0.33,-11.28 0 top  (outside the outline)
R46  0  [R0402]  -0.43,-16.08 0 top  (outside the outline)
R47  1ohm  [SMD_0402]  123.16,89.2 270 bottom
R48  1ohm  [SMD_0402]  27.97,91.52 270 bottom
R49  1ohm  [SMD_0402]  65.2,87.91 270 bottom
R50  1ohm  [SMD_0402]  110.49,91.57 270 bottom
R51  1ohm  [SMD_0402]  52.58,92.96 270 bottom
R52  1ohm  [SMD_0402]  16.79,90.63 270 bottom
R53  1K  [SMD_0402]  47.65,85.95 0 top
R54  27  [R0402]  127.36,48.9 0 bottom
R55  27  [R0402]  127.46,47.35 0 bottom
R56  100  [R0402]  2.06,68.91 270 top
R57  4.7K  [R0402]  21.54,13.34 0 top
R58  4.7K  [R0402]  21.46,11.94 0 top
R59  10K  [R0402]  105.94,12.24 0 top
R60  1.5M  [R0402]  26.34,11.91 180 top
R61  100K  [R0402]  116.71,50.5 270 bottom
R62  100K  [R0402]  115.06,50.55 270 bottom
R63  100K  [R0402]  107.16,42.39 90 bottom
R64  100K  [R0402]  108.56,42.39 90 bottom
R65  1K  [SMD_0402]  29.59,75.54 90 top
R66  10K  [R0402]  113.54,50.52 270 bottom
R67  2.7K  [SMD_0402]  12.47,40.89 270 bottom
R68  2.7K  [SMD_0402]  14,40.08 270 bottom
R69  0  [R0402]  106.45,21.84 180 top
R70  0  [R0402]  -0.43,-20.83 0 top  (outside the outline)
R71  0  [R0402]  33.43,10.9 180 top
R72  0  [R0402]  3.53,67.06 0 top
R73  0  [R0402]  114.58,46.69 180 bottom
R74  0  [R0402]  106.1,53.19 90 top
R75  0  [R0402]  32.89,8.15 90 top
R76  4.7K  [R0402]  19.96,34.62 0 top
R77  4.7K  [R0402]  22.63,34.7 0 top
R78  7.5_0p25W_0805  [M0805]  100.79,32.49 270 top
R79  360K  [R0402]  108.31,30.45 90 top
R80  510K  [R0402]  108.33,27.97 90 top
R81  110K  [R0402]  106.83,26.01 0 top
R82  1M  [R0402]  106.96,32.31 180 top
R83  0  [R0402]  109.14,36.96 90 top
R84  10K  [R0402]  115.14,38.58 180 bottom
R85  0  [R0402]  -0.43,-25.58 0 top  (outside the outline)
R86  330  [R0402]  83.64,29.62 180 top
R87  0  [R0402]  -0.43,-30.33 0 top  (outside the outline)
R88  10K  [SMD_0402]  43.54,33.58 270 top
R89  10K  [SMD_0402]  41.27,37.19 180 top
R90  3  [R0402]  80.57,18.64 180 top
R91  DNS_0  [SMD_0402]  76.94,19.76 0 top
R92  1K  [SMD_0402]  85.29,20.98 0 top
R94  10K  [R0402]  18.29,65.46 0 top
R95  20  [R0402]  26.39,33.4 0 top
R96  1M  [R0402]  15.24,67.21 0 top
SD1  SD_CARD  [SD_CARD]  111.99,47.35 90 top
SW1  SWITH_NO  [SW_SQ]  21.36,74.65 0 top
SW2  SWITCH_TOG_RA  [SW_TOG_RA]  127.33,57.71 0 bottom
SW3  SW_PBUTTON_RA  [SW_PBUTTON_RA]  134.26,37.11 180 bottom
T1  [TESTP_SM]  91.26,20.9 0 top
T2  [TESTP_SM]  3.1,96.85 0 top
T3  [TESTP_SM]  2.49,8.84 0 top
T4  [TESTP_SM]  71.93,56.03 0 top
T5  [TESTP_SM]  46.15,46.43 0 top
T6  [TESTP_SM]  139.9,21.95 0 top
T7  [TESTP_SM]  33.53,37.08 0 top
T8  [TESTP_SM]  33.53,39.62 0 top
T12  [TESTP_SM]  132.31,2.18 0 top
T13  [TESTP_SM]  115.39,25.02 0 top
TP1  TP_THSM2  [TP_THSM2]  133.88,96.34 0 top
TP2  TP_THSM2  [TP_THSM2]  44.65,75.8 0 top
TP3  TP_THSM2  [TP_THSM2]  129.79,96.2 0 top
TP4  TP_THSM2  [TP_THSM2]  47.45,75.76 0 top
TP5  TP_THSM2  [TP_THSM2]  131.2,85.13 0 top
TP6  TP_THSM2  [TP_THSM2]  126.85,96.37 0 top
TP7  TP_THSM2  [TP_THSM2]  87.66,95.63 0 top
TP8  TP_SMT  [TP_SMT]  63.47,55.02 0 top
TP9  TP_SMT  [TP_SMT]  36.04,16.94 0 top
TP10  TP_SMT  [TP_SMT]  139.73,18.92 0 top
TP11  TP_THSM  [TP_THSM]  40.54,5.71 0 top
TP12  TP_THSM  [TP_THSM]  120.12,25.1 0 top
TP13  TP_THSM  [TP_THSM]  122.4,25.04 0 top
TP14  TP_THSM2  [TP_THSM2]  133.88,72.19 0 top
TP15  TP_THSM  [TP_THSM]  42.7,23.65 90 top
TP16  TP_THSM2  [TP_THSM2]  136.3,70.21 90 top
TP17  TP_THSM2  [TP_THSM2]  110.39,14.5 90 top
TP18  TP_SMT  [TP_SMT]  63.65,30.43 0 top
TP19  TP_SMT  [TP_SMT]  120.88,32.23 0 top
TP20  TP_SMT  [TP_SMT]  -0.23,-5.38 0 top  (outside the outline)
TP21  TP_SMT  [TP_SMT]  64.69,56.82 0 top
TP22  TP_SMT  [TP_SMT]  115.44,2.84 0 top
TP23  TP_SMT  [TP_SMT]  110.36,51.28 0 top
TP24  TP_THSM2  [TP_THSM2]  30.86,95.45 180 top
TP25  TP_SMT  [TP_SMT]  -0.91,-12.73 0 top  (outside the outline)
TP26  TP_SMT  [TP_SMT]  71.96,33.78 90 top
TP27  TP_SMT  [TP_SMT]  71.73,31.09 90 top
TP29  TP_SMT  [TP_SMT]  49.3,28.73 90 top
TP31  TP_SMT  [TP_SMT]  84.84,22.2 90 top
TP32  TP_SMT  [TP_SMT]  89.26,21.92 90 top
TP41  TP_SMT  [TP_SMT]  37.01,6.6 90 top
TP42  TP_SMT  [TP_SMT]  37.49,17.93 90 top
TP43  TP_SMT  [TP_SMT]  35.48,15.72 90 top
TP46  TP_SMT  [TP_SMT]  24.79,66.93 90 top
U1  LTC4053  [LTC4053]  22.55,93.21 0 bottom
U2  LTC4053  [LTC4053]  117.68,91.69 0 bottom
U3  LTC4053  [LTC4053]  58.16,88.23 0 bottom
U4  LTC4053  [LTC4053]  105.13,91.62 0 bottom
U5  LTC4053  [LTC4053]  47.97,93.7 0 bottom
U6  HUMIDITY_A  [HUMIDITY_A]  17.09,12.19 0 top
U7  VOLT_SUPR  [TO236]  69.76,91.43 0 bottom
U8  FLIGHTSENSE_L5  [FLIGHT_SENSE_L5]  36.78,30.84 0 top
U10  LTC4053  [LTC4053]  12.42,92.99 0 bottom
U11  VREG_SW_LM2677  [TO263-7]  40.67,91.44 0 top
U12  SRAM_16M_2X16  [TSOP_54]  92.76,47.7 0 top
U13  ALS  [ALS]  21.34,32.69 180 top
U15  UBLOX_M8  [UBLOX_M8]  133.27,14.43 0 bottom
U16  Ferrite_180  [0402-CAP]  45.49,32.66 180 top
U17  FLASH_SPI  [WSON_8]  91.26,30.02 0 top
U18  3.6v  [SOT_235B]  76.58,17.2 270 top
U19  LTC1998  [SOT23-6L]  105.51,28.98 0 top
U20  ALTIMETER_TEC  [ALTIMETER_TEC]  12.55,5.26 0 top
U24  ATTINY_817_QFN  [QFN24]  39.17,10.9 0 top
U$1  LCD_3V_SMALL  [LCD_3V_SMALL]  74.17,63.86 0 top
U$5  STM32H743ZIT6  [LQFP144@1]  58.98,42.6 0 top
X1  12MHz  [XTAL_SMALL]  60.99,26.95 180 top
X2  TCXO_32K_BGA  [TCXO_32K_BGA]  54.1,28.65 90 top

## Tracks (layer width: path | path; a pad name or v marks a point on that pad's centre or on a via)
5VREG_OUT  (via drill 0.2 pad 0.46)
  Top 0.203: 21.31,83.31 21.26,83.41 v21.44,83.31
  Top 0.254: R14.P$1 R8.P$1 8.13,75.23 9.83,75.23 9.86,75.29 9.86,75.31 13.69,75.31 15.77,83.31 21.31,83.31 27.1,74.94 R3.P$1 27.61,74.98 27.53,74.91 27.13,74.91 | v19.79,96.44 22.4,96.44 v22.71,96.65 22.53,96.47 22.53,96.16 23.22,95.48 v24.33,95.48 | v45.24,97.41 47.73,97.41 v48.01,97.23 48.36,96.88 49.25,95.45 51.16,95.12 51.41,94.87 51.41,90.93 51.59,90.75 51.59,89.94 50.95,89.31 v50,89.31 v49.99,89.3 | v119.58,88.14 119.58,94.28 119.02,94.84 115.04,94.84 v114.96,94.77 | v106.98,96.47 108.41,96.47 109.42,95.45 109.42,90.81 v105.97,88.14 105.21,87.38 v102.89,87.38 | v101.17,93.32 v94.31,93.32 | v62.61,92.84 62.26,89.74 60.63,88.16 59.48,87.12 v59.49,85.03 59.49,84.53 59.49,83.59 59.98,83.1 | R65.P$1 30.99,75.01 32.15,75.01 C26.1 | I1.P$3 42.41,77.97 42.8,78.36 | 64.09,75.58 63.13,75.58 62.87,75.84 62.87,80.21 59.98,83.1 | v59.41,82.75 59.64,82.75 59.98,83.1
  Top 0.305: R3.P$1 R65.P$1 29.54,74.96 arc45 29.28,75 | R9.P$1 R7.P$1 | R15.P$1 R13.P$1 | R28.P$1 R30.P$1 | R19.P$1 50.49,75.31 | 50.49,75.31 49.99,75.31 R21.P$1 | R24.P$2 R24.P$1 | v44.37,78.84 44.37,78.13 | v48.56,74.17 49.94,75.31 50.49,75.31
  Top 0.406: 64.88,75.61 65.06,75.58 64.09,75.58 R9.P$1 | 111.31,73.88 111.36,73.9 | 111.36,73.9 110.19,73.9 R15.P$1 | R24.P$1 46.78,74.46 47.09,74.73 47.47,75.66 TP4.P$1 | 130.68,68.83 R28.P$1 | R24.P$2 45.14,74.41 45.01,74.47 44.81,74.58 TP2.P$1 44.37,76.08 44.37,78.13 | v46.79,83.46 46.79,82.75 45.97,81.94 45.97,81.81 45.24,81.08 43.46,81.08 43.2,81.33 | v55.35,90.81 51.21,95.17 51.16,95.12 | R30.P$1 129.21,68.89 128.19,68.83 v127.48,69.55 | 65.71,75.73 R7.P$1 | 42.8,78.36 42.8,78.41 43.31,78.92 44.3,78.92 v44.37,78.84 | v32.38,82.42 32.38,80.8 30.91,79.32 30.91,75.09 30.99,75.01 | 111.36,73.9 112.44,73.9 112.65,74.12 112.65,84.33 113.18,84.86 114.15,84.86 115.65,83.36 118.39,83.36 v118.49,83.46 118.62,83.34 v122.38,83.34
  Top 0.61: U11.6 43.2,81.33 43.2,77.22 | 43.2,77.22 I1.P$3 | 42.77,77.29 42.84,77.22 43.2,77.22
  Route2 0.305: 47.7,74.68 47.9,74.32 v48.56,74.17
  Route2 0.406: v32.38,82.42 32.64,82.17 33.12,82.17 36.32,79.6 45.16,79.6 v45.31,79.38 | 47.7,74.68 47.7,75.51 TP4.P$1
  Bottom 0.254: R20.P$1 8.76,95.89 10.08,97.21 12.24,97.21 12.32,97.18 | 12.32,97.18 12.39,97.05 | 12.39,97.05 12.39,95.22 U10.P$8 | U10.P$8 12.42,97.03 12.39,97.05 | 12.32,97.18 11.91,97.18 11.86,97.23 | U2.P$8 117.68,96.34 117.55,96.44 | 23.82,89.86 23.82,88.42 23.93,88.32 | v49.99,89.3 49.58,89.71 | 49.58,89.71 48.62,90.68 | 48.62,90.68 48.56,90.68 48.46,90.81 | 48.46,90.81 48.46,91.53 U5.P$2 48.47,90.77 48.46,90.81 | U4.P$2 105.63,88.45 105.61,88.24 v105.97,88.14 | 118.21,88.59 118.69,88.11 119.61,88.11 119.61,86.18 118.45,85.03 C9.1 118.34,84.88 | 118.21,88.59 118.21,88.65 | 118.21,88.65 118.21,89.46 U2.P$2 118.18,88.68 118.21,88.65 | U10.P$8 12.42,97.18 12.37,97.23 18.26,97.23 19.43,97.23 19.74,96.93 19.74,94.96 R4.P$1 19.75,96.41 v19.79,96.44 | v22.71,96.65 22.53,96.22 22.53,95.43 U1.P$8 | U1.P$2 23.05,90.21 23.06,90.19 24.41,90.19 24.94,90.58 24.94,91.47 24.46,92.15 24.49,95.33 v24.33,95.48 | v21.44,83.31 21.16,84.68 23.04,86.56 23.04,87.35 C1.1 | R22.P$1 45.17,96.88 v45.24,97.41 | v48.01,97.23 48.01,96.77 47.95,96.72 47.95,95.91 U5.P$8 | 48.46,90.81 48.56,90.73 48.62,90.68 | 49.58,89.71 49.61,89.71 50.01,89.31 | 118.21,88.59 118.21,88.57 118.69,88.09 119.53,88.09 v119.58,88.14 | v114.96,94.77 113.9,94.77 113.84,94.7 113.84,94.92 114.66,95.73 113.26,95.73 112.29,96.77 106.73,96.77 | 105.13,96.32 105.46,96.77 106.73,96.77 | 105.13,96.32 U4.P$8 | U4.P$8 105.13,96.32 | 105.11,96.32 103.68,96.32 102.54,95.17 102.54,93.56 R16.P$1 101.2,93.35 v101.17,93.32 | U4.P$8 105.13,96.29 105.11,96.32 | 105.11,96.32 105.13,96.32 | 106.73,96.77 v106.98,96.47 | v94.31,93.32 93.39,93.32 93.36,93.34
  Bottom 0.254: U3.P$8 58.19,92.71 58.24,92.84 v62.61,92.84 | v59.49,85.03 58.86,85.15 58.8,85.09 | C5.1 102.33,86.81 v102.89,87.38 | C3.1 59.28,82.62 v59.41,82.75
  Bottom 0.305: U3.P$8 58.11,92.3 58.14,92.79 | R26.P$1 73.13,88.66 73.03,89.18 73.03,89.97 73.13,90.53 | 73.13,90.53 72.64,90.53 | 72.64,90.53 72.13,90.53 U7.3 | R25.P$1 72.62,90.55 72.64,90.53 | Q3.2 73.92,91.7 73.46,91.24 73.46,90.86 73.13,90.53 | U1.P$2 23.05,90.23 23.11,90.17 23.52,90.17 23.82,89.86 23.82,88.14 | 59.11,85.04 v59.49,85.03 59.05,85.04 58.8,85.09 58.67,85.32 58.67,86.02 U3.P$2 | 118.52,84.92 C9.1 | U10.P$8 12.42,97.23 12.39,97.26 18.24,97.26 18.26,97.23 18.26,92.15 17.75,91.64 17.78,89.08 15.52,87.15 13.16,87.2 12.9,87.45 12.9,88.35 C14.1 13.11,88.69 13.13,89.99 12.95,90.18 U10.P$2
  Bottom 0.406: U7.3 69.52,92.41 65.68,92.66 62.15,92.91 58.14,92.79 55.98,92.46 55.44,92.18 R10.P$1 55.37,90.79 v55.35,90.81 | 117.55,96.44 116.23,96.44 114.48,95.73 113.84,94.7 114.1,93.19 R31.P$1 | D7.1_K 93.15,85.17 D8.1_K 93.23,87.29 D12.1_K 93.11,89.51 | 93.11,89.51 D11.1_K 93.39,92.14 D10.1_K 93.36,93.34 93.36,94.25 D9.1_K | 23.82,88.14 C1.1 | v49.99,89.3 C7.1 50.98,86.61 50.7,86.33 50.11,86.28 49.91,86.16 49.99,83.57 47.68,83.34 46.84,83.44 v46.79,83.46 | 93.11,89.51 93.11,89.76 93.4,90.04 93.4,93.27 93.32,93.34 88.27,93.37 87.27,92.73 83.34,92.35 80.03,89.05 73.6,89.05 R26.P$1 | v118.49,83.46 118.49,84.95 C9.1 | v127.48,69.55 124.59,80.44 v122.38,83.34 | v45.31,79.38 45.31,79.32 47.12,77.52 47.12,76.09 TP4.P$1
AGND  (via drill 0.2 pad 0.46)
  Top 0.254: J2.P2 31.11,41.61 31.88,40.84 31.93,36.45 32.16,35.89 32.16,34.76 F2.1
  Top 0.406: IC4.2 7.37,62.74 6.16,61.53 C74.2 6.13,61.39 C31.2 6.13,61.48 6.1,61.52 5.92,61.52 v5.08,62.36 | F2.1 30.67,34.75 C93.1 30.61,34.68 30.61,33.45 30.48,33.33 29.03,33.33 27.79,34.59 25.4,34.59 24.74,37.95 20.4,38.51 17.25,38.73 16,40.01 15.75,40.13 15.85,40.06 14.5,41.4 v14.17,41.68 | C32.2 3.34,70.6 3.63,70.31 3.63,70.18 v3.68,70.13
  Route2 0.406: v3.68,70.13 2.46,70.13 2.31,69.98 2.31,67.74 3.12,66.93 3.12,66.27 5.11,64.29 5.11,62.38 v5.08,62.36
  Bottom 0.406: v5.08,62.36 13.97,59.16 13.97,55.09 13.89,41.96 v14.17,41.68
BATT
  Top 0.305: R79.2 108.04,31.32 105.72,31.32 105.51,31.11 U19.5 105.49,30.26 105.49,29.18 104.56,28.26 U19.1 103.94,27.68 103.12,28.5 102.3,28.5 C102.1P 102.37,28.53 103.12,29.29 103.12,31.23 D5.A
BIG_TINY_CLK  (via drill 0.2 pad 0.46)  (1 unrouted)
  Top 0.203: U24.P$20 39.66,19.32 v39.73,20.78 | v51.36,41.15 51.36,41.83 50.88,42.32 48.26,42.32 U$5.127 | TP29.P$1 49.3,28.75 v50.16,28.78
  Route2 0.203: v39.73,20.78 v46.91,23.44
  Bottom 0.203: v46.91,23.44 50.58,28.73 | 50.58,28.73 51.36,29.54 v51.36,41.15 | v50.16,28.78 50.23,28.75 50.58,28.73
BIG_TINY_DAT  (via drill 0.2 pad 0.46)  (1 unrouted)
  Top 0.203: U24.P$16 43.91,11.2 45.64,9.98 55.8,9.96 57.15,12.24 58.88,13.89 60.91,14.05 v64.03,17.12 | v72.8,38.63 72.44,38.63 72.16,38.35 U$5.46
  Top 0.254: TP27.P$1 70.84,31.09 v70.69,30.84
  Route2 0.203: v64.03,17.12 70.21,27.99 70.51,28.85 v70.69,30.84
  Bottom 0.203: v70.69,30.84 70.79,33.43 71.17,34.29 71.2,34.59 71.27,35.03 71.27,37.11 v72.8,38.63
BOOT0  (via drill 0.2 pad 0.46)
  Top 0.203: v53.87,40.23 53.37,39.62 53.37,37.47 52.75,36.85 U$5.138 47.19,36.85 46.08,36.96 44.78,36.85 42.15,36.85 R89.P$1 41.81,37.62 41.53,37.9 38.15,37.9 v38.12,37.92 | v66.98,39.45 67.08,39.45 67.16,39.37 69.7,39.37 U$5.48
  Route2 0.203: v53.87,40.23 55.63,40.23 55.93,39.93 66.5,39.93 v66.98,39.45 | v38.12,37.92 34.37,37.92 T7.P$1
CAM_2V8_AVDD  (via drill 0.2 pad 0.46)
  Top 0.254: J2.P4 29.51,42.61 29.01,42.11 29.39,34.99 C93.2
  Top 0.406: C31.1 7.86,60.02 C74.1 8.32,61.87 IC4.5 8.32,61.94 7.85,61.47 7.85,60.1 7.98,59.97 17.96,60.1 17.96,55.58 v17.93,55.58 | v16.66,41 28.19,40.97 29.01,42.11
  Bottom 0.406: v17.93,55.58 17.75,42.01 17.73,42.04 17.6,41.88 v16.66,41
CAM_3V0_DOVDD  (via drill 0.2 pad 0.46)
  Top 0.203: R36.P$1 R40.P$1 v32.61,42.32 | v29.16,46.02 29.13,45.87 29.36,46.1 J2.P11 32.16,46.11 C76.2
  Top 0.406: IC1.5 C89.1 3.85,60.43 C75.1 9.09,58.93 13.97,58.93 13.97,55.09 v15.24,54.48 | v16.31,43.31 25.35,43.31 26.06,44.65 26.9,45.01 v29.16,46.02
  Bottom 0.203: v32.61,42.32 32.66,42.32 v29.16,46.02
  Bottom 0.406: v15.24,54.48 15.34,44.22 v16.31,43.31
CAM_PWRC
  Top 0.203: U$5.117 43.43,47.37 42.42,46.35 40.95,46.35 38.43,48.87 38.43,50.8 34.54,54.81 20.65,54.81 19.61,53.65 16.94,53.65 15.9,52.6 5.99,52.6 0.96,57.63 0.96,64.67 1.29,65 IC1.3
  Top 0.406: R56.2 1.19,67.93 1.19,66.04 2.02,65.64 IC1.3 2.02,65.62 1.91,65.73 1.5,65.73 1.37,65.86
DCMI_CLK  (via drill 0.2 pad 0.46)  (1 unrouted)
  Top 0.203: J2.P13 32.89,47.14 v32.94,47.19 | v54.33,59.84 54.71,58.98 54.66,55.75 54.23,55.27 54.23,54.21 54.2,53.37 U$5.100 | IR1.P$26 5.32,31.41 5.92,30.81 6.12,30.81 v6.76,30.66
  Route2 0.203: v37.24,59.18 37.57,59.18 38.51,59.89 v54.33,59.84 | v6.76,30.66 9.93,30.66 12.06,32.79 12.06,32.92 14.58,36.09 34.59,36.09 v35.31,36.35
  Bottom 0.203: v37.24,59.18 37.03,58.98 37.03,57.84 36.04,56.84 v32.94,47.19 34.77,46.84 v35.31,36.35
DCMI_D0  (via drill 0.2 pad 0.46)
  Top 0.203: J2.P19 31.9,50.11 32.31,49.71 v32.28,49.71 32.28,49.76 | v56.11,60.98 56.21,60.48 56.21,53.36 U$5.96
  Route2 0.203: v36.25,60.55 36.6,60.55 37.21,61.16 55.98,61.16 55.98,60.98 v56.11,60.98
  Bottom 0.203: v32.28,49.71 35.38,57.05 36.27,57.94 36.27,60.53 v36.25,60.55
DCMI_D1  (via drill 0.2 pad 0.46)
  Top 0.203: J2.P21 v29.17,51.11 | v55.32,60.48 55.73,59.77 U$5.97
  Route2 0.203: v35.53,58.24 37.57,60.48 v55.32,60.48
  Bottom 0.203: v29.17,51.11 30.84,53.37 34.72,57.43 34.72,58.24 v35.53,58.24
DCMI_D2
  Top 0.203: J2.P22 32.36,51.61 33.22,51.56 35.38,50.52 39.62,46.28 40.01,45.87 42.55,43.33 48.22,43.33 U$5.125
DCMI_D3
  Top 0.203: J2.P20 33.82,50.61 35,50.16 42.34,42.82 48.21,42.82 U$5.126
DCMI_D4  (via drill 0.2 pad 0.46)
  Top 0.203: J2.P18 29.25,49.64 v29.21,49.61 | v31.75,27.96 51.23,27.94 U$5.3
  Bottom 0.203: v29.21,49.61 28.52,49.61 28.57,42.19 29.82,42.19 29.74,42.09 29.67,31.83 31.27,30.86 31.67,28.02 v31.75,27.96
DCMI_D5
  Top 0.203: J2.P16 32.03,48.61 34.59,48.26 37.52,45.34 39.01,44.63 39.27,44.57 42.55,41.3 42.57,38.46 45.82,38.48 46.86,38.48 46.86,37.87 48.1,37.87 U$5.136
DCMI_D6  (via drill 0.2 pad 0.46)
  Top 0.203: J2.P14 28,47.61 v27.79,47.4 | v29.79,27.33 50.77,27.33 51.71,27.74 51.71,31.83 U$5.4
  Bottom 0.203: v27.79,47.4 28.09,47.4 28.09,41.5 29.16,41.5 29.03,31.39 28.63,29.03 v29.79,27.33
DCMI_D7  (via drill 0.2 pad 0.46)
  Top 0.203: J2.P12 27.94,46.61 v27.1,46.15 | v29.01,26.75 50.98,26.75 52.22,27.61 52.22,31.84 U$5.5
  Bottom 0.203: v27.1,46.15 27.43,46.13 27.43,39.12 27.99,39.12 27.99,38.46 28.04,32.72 27.99,31.62 26.16,30.56 26.21,28.47 28.19,27.2 v29.01,26.75
DCMI_HSYNC  (via drill 0.2 pad 0.46)
  Top 0.203: J2.P9 36.83,45.09 36.93,44.98 37.97,41.56 v38.25,41.48 | v64.41,35.79 64.97,35.79 65.43,35.33 69.71,35.33 U$5.40
  Route2 0.203: v38.25,41.48 48.26,41.53 51.18,38.56 61.65,38.56 v64.41,35.79
DCMI_I2C1_SCL
  Top 0.203: J2.P5 34.95,43.09 | 34.95,43.09 36.08,40.09 38.43,36.3 44.98,36.32 46.1,36.52 47.35,36.37 48.18,36.4 U$5.139 | R40.P$2 34.87,42.6 34.95,43.09
DCMI_I2C1_SDA
  Top 0.203: J2.P3 31.57,42.11 32.79,40.56 34.75,40.58 | 34.75,40.58 34.85,40.59 37.92,35.81 45.01,35.84 46,36.07 47.3,35.84 48.2,35.81 U$5.140 | R36.P$2 34.62,40.71 34.75,40.58
DCMI_PCLK  (via drill 0.2 pad 0.46)
  Top 0.203: U$5.42 67.49,36.35 67.16,36.02 65.53,36.02 64.67,36.88 61.09,36.88 60.17,35.97 58.75,35.97 57.38,37.34 57.38,40.95 56.21,42.04 56.21,45.62 55.09,45.62 v52.96,45.54 | v35.33,48.74 35.15,48.95 R41.P$2
  Route2 0.203: v52.96,45.54 47.95,45.54 47.3,44.35 41.17,44.35 v35.33,48.74
DCMI_PCLKR
  Top 0.203: R41.P$1 33.17,49.3 33.22,49.1 30.48,49.12 J2.P17
DCMI_PWDN  (via drill 0.2 pad 0.46)
  Top 0.203: J2.P8 36.41,44.61 37.72,40.49 39.24,40.49 v39.37,40.62 | v41.66,45.72 41.58,45.62 43.13,44.07 45.26,44.07 45.52,44.32 48.21,44.32 U$5.123
  Bottom 0.203: v39.37,40.62 39.37,43.48 v41.66,45.72
DCMI_RST  (via drill 0.2 pad 0.46)
  Top 0.203: J2.P6 35.64,43.61 v35.89,43.87 | v53.39,59.26 53.24,59.16 U$5.102
  Route2 0.203: v38.25,58.73 38.58,58.98 39.14,59.28 v53.39,59.26
  Bottom 0.203: v35.89,43.87 36.63,56.31 37.87,57.56 37.87,58.34 v38.25,58.73
DCMI_VSYNC  (via drill 0.2 pad 0.46)
  Top 0.203: J2.P7 29.28,44.11 v29.26,44.09 | v37.47,39.29 37.72,39.14 41.99,38.53 42.37,38.08 46.35,38.05 46.43,37.36 48.21,37.36 U$5.137
  Route2 0.203: v29.26,44.09 34.24,44.09 35.31,43.03 36.35,43.03 v37.47,39.29
DISABLE_PWR
  Top 0.203: R59.2 107.44,12.24 108.28,13.08 IC2.3 109.43,15.46 TP17.P$1
DRAM_A0  (via drill 0.2 pad 0.46)
  Top 0.203: U12.P$23 v101.06,40.54 v101.07,40.54 | v100.31,23.95 95.94,23.8 94.92,24.03 56.87,24.03 56.24,24.33 56.24,29.57 54.71,30.63 54.71,31.83 U$5.10
  Bottom 0.203: v101.07,40.54 101.02,24 v100.31,23.95
DRAM_A1  (via drill 0.2 pad 0.46)
  Top 0.203: U12.P$24 101.86,39.59 v101.88,39.57 | v56.52,40.56 56.54,38.2 55.19,36.85 55.19,31.88 U$5.11
  Route2 0.203: v101.88,39.57 81.74,39.57 80.54,40.77 57.02,40.77 v56.52,40.56
DRAM_A2  (via drill 0.2 pad 0.46)
  Top 0.203: U12.P$25 102.66,37.13 v102.16,36.63 | v56.24,35.05 56.01,35.05 55.73,34.77 U$5.12
  Route2 0.203: v102.16,36.63 95.3,36.63 94.67,35.99 75.34,35.99 74.4,35.05 v56.24,35.05
DRAM_A3  (via drill 0.2 pad 0.46)
  Top 0.203: U12.P$26 103.46,36.33 v103.05,35.92 | v56.74,34.29 56.24,34.29 U$5.13
  Route2 0.203: v103.05,35.92 95.58,35.92 95.07,35.41 75.77,35.41 74.95,34.59 57.05,34.59 v56.74,34.29
DRAM_A4  (via drill 0.2 pad 0.46)
  Top 0.203: U12.P$29 103.46,48.43 v110.64,45.57 | v110.26,24.51 108.51,24.51 108.51,24.66 105.99,24.66 105.99,24.51 58.01,24.51 56.72,24.71 56.72,31.84 U$5.14
  Bottom 0.203: v110.64,45.57 110.69,24.64 v110.26,24.51
DRAM_A5  (via drill 0.2 pad 0.46)
  Top 0.203: U12.P$30 102.79,47.96 v109.42,45.24 | v109.3,25.15 57.81,25.15 57.15,25.38 U$5.15
  Bottom 0.203: v109.42,45.24 109.42,25.45 v109.3,25.15
DRAM_A6
  Top 0.203: U12.P$31 101.86,50.38 97.99,46.51 97.99,44.88 97.89,44.78 81.76,44.78 77.32,40.34 69.74,40.34 U$5.50
DRAM_A7
  Top 0.203: U12.P$32 101.06,50.39 97.36,46.69 97.36,45.19 81.36,45.19 78.05,41.88 69.77,41.88 U$5.53
DRAM_A8
  Top 0.203: U12.P$33 100.26,50.43 96.75,46.91 96.77,45.57 81.08,45.57 77.72,42.39 69.78,42.39 U$5.54
DRAM_A9
  Top 0.203: U12.P$34 99.46,50.44 96.11,47.09 96.11,45.92 80.44,45.92 77.34,42.9 69.78,42.9 U$5.55
DRAM_A10  (via drill 0.2 pad 0.46)
  Top 0.203: U12.P$22 100.26,44.08 v100.36,44.17 | v66.65,43.36 69.72,43.36 U$5.56
  Route2 0.203: v100.36,44.17 100,44.17 98.53,42.82 67.36,42.82 v66.65,43.36
DRAM_A11
  Top 0.203: U12.P$35 98.66,50.38 95.56,47.27 95.56,46.35 95.58,46.33 79.5,46.33 77.11,43.81 69.83,43.81 U$5.57
DRAM_A12
  Top 0.203: U12.P$36 97.86,60 97.77,60.1 83.62,60.1 83.62,60.76 80.64,60.76 80.64,60.12 61.77,60.1 60.76,59.99 60.71,59.99 59.84,58.22 59.84,57.1 60.76,55.55 60.76,53.37 U$5.87
DRAM_BA0  (via drill 0.2 pad 0.46)
  Top 0.203: U12.P$20 98.66,43.68 v98.42,43.92 | v59.77,49.48 59.77,53.31 U$5.89
  Route2 0.203: v98.42,43.92 96.83,43.92 94.54,46.2 92.96,46.2 90.22,48.95 60.3,48.95 v59.77,49.48
DRAM_BA1  (via drill 0.2 pad 0.46)
  Top 0.203: U12.P$21 99.46,44.41 v98.98,44.88 | v58.65,49.76 58.65,50.67 59.23,51.26 U$5.90
  Route2 0.203: v98.98,44.88 98.04,44.88 94.87,48.06 92.51,48.06 91.06,49.51 60.98,49.51 60.3,50.19 59.08,50.19 v58.65,49.76
DRAM_CAS  (via drill 0.2 pad 0.46)
  Top 0.203: U12.P$17 96.26,40.44 v96.32,40.39 | v52.55,39.85 U$5.132
  Route2 0.203: v96.32,40.39 96.11,40.39 95.86,40.01 81.84,39.98 80.82,41.12 53.85,41.15 v52.55,39.85
DRAM_CLK  (via drill 0.2 pad 0.46)
  Top 0.203: 93.73,61.09 93.98,61.11 | 93.98,61.11 58.34,61.11 57.78,60.83 57.76,53.38 U$5.93 | U12.P$38 v96.26,54.81 v96.27,54.81 | v96.19,61.01 94.67,61.01 93.98,61.11
  Bottom 0.203: v96.27,54.81 96.24,60.81 v96.19,61.01
DRAM_CLKE  (via drill 0.2 pad 0.46)
  Top 0.203: U12.P$37 97.06,49.99 v94.16,47.09 | v93.75,37.24 77.83,37.24 76.3,36.47 74.19,36.47 72.9,37.82 69.75,37.82 U$5.45
  Bottom 0.203: v94.16,47.09 94.16,37.19 v93.75,37.24
DRAM_CS  (via drill 0.2 pad 0.46)
  Top 0.203: U12.P$19 97.86,39.53 98.42,38.96 98.42,37.08 97.16,35.81 78.05,36.07 73.81,36.07 v73.51,36.14 | v66.32,36.75 66.32,36.88 66.8,37.36 69.71,37.36 U$5.44
  Route2 0.203: v73.51,36.14 67.08,36.14 v66.32,36.75
DRAM_D0  (via drill 0.2 pad 0.46)
  Top 0.203: U12.P$2 v84.26,43.48 v84.25,43.48 | v82.45,60.2 81.79,60.15 81.76,59.46 61.37,59.44 60.38,58.12 60.38,57.28 61.72,55.96 U$5.85
  Bottom 0.203: v84.25,43.48 84.25,53.52 82.42,55.35 82.45,58.98 v82.45,60.2
DRAM_D1  (via drill 0.2 pad 0.46)
  Top 0.203: U12.P$4 85.86,43.47 v85.88,43.48 | v87.45,58.5 87.33,58.5 87.33,58.65 62.36,58.65 v62.18,58.57 | v61.24,50.75 61.24,53.34 U$5.86
  Bottom 0.203: v85.88,43.48 85.88,53.98 87.43,55.52 87.43,58.62 v87.45,58.5 | v62.18,58.57 62.18,51.69 v61.24,50.75
DRAM_D2  (via drill 0.2 pad 0.46)
  Top 0.203: U12.P$5 86.66,43.07 87,43.41 87,43.89 v86.79,44.09 | v77.62,63.83 76.94,63.86 76.61,63.17 61.77,63.17 61.14,64.52 40.51,64.52 v39.22,63.02 | v39.32,48.84 U$5.114
  Bottom 0.203: v86.79,44.09 86.79,53.14 88.67,55.73 88.72,55.91 88.72,61.01 83.24,60.98 82.32,64.26 79.43,63.68 v77.62,63.83 | v39.22,63.02 39.22,48.95 v39.32,48.84
DRAM_D3  (via drill 0.2 pad 0.46)
  Top 0.203: U12.P$7 88.26,43.51 v88.04,43.74 | v88.85,62.87 88.85,63.07 87.33,62.87 82.25,62.84 81.25,62.71 40.87,62.66 v40.36,63.14 | v40.34,48.03 40.77,48.03 41.1,48.36 48.21,48.36 U$5.115
  Bottom 0.203: v88.04,43.74 88.04,53.54 89.48,55.68 89.43,62.08 v88.85,62.87 | v40.36,63.14 40.36,48.06 v40.34,48.03
DRAM_D4  (via drill 0.2 pad 0.46)
  Top 0.203: U12.P$8 89.06,44.15 v89.05,44.02 | v89.46,46.89 78.94,46.89 76.3,44.25 69.83,44.25 U$5.58
  Bottom 0.203: v89.05,44.02 89.08,46.51 v89.46,46.89
DRAM_D5  (via drill 0.2 pad 0.46)
  Top 0.203: U12.P$10 90.66,43.76 v90.47,43.94 | v66.8,44.83 69.71,44.83 U$5.59
  Route2 0.203: v90.47,43.94 90.47,44.83 90.02,45.29 77.32,45.31 75.29,44.04 73.41,44.04 70.43,45.31 67.26,45.29 v66.8,44.83
DRAM_D6  (via drill 0.2 pad 0.46)
  Top 0.203: U12.P$11 91.46,43.78 v91.54,43.87 | v72.8,45.19 72.54,45.24 72.16,45.36 69.75,45.36 U$5.60
  Route2 0.203: v91.54,43.87 91.54,44.68 90.27,45.95 74.37,45.95 v72.8,45.19
DRAM_D7  (via drill 0.2 pad 0.46)
  Top 0.203: U12.P$13 93.06,43.63 v93.55,44.12 | v73.61,46.74 71.09,46.74 70.99,46.84 69.74,46.84 U$5.63
  Route2 0.203: v93.55,44.12 93.27,44.12 89.79,47.6 74.47,47.6 v73.61,46.74
DRAM_D8
  Top 0.203: U$5.64 90.4,47.47 93.04,50.01 93.04,53.28 U12.P$42
DRAM_D9
  Top 0.203: U$5.65 89.3,47.85 91.44,49.99 91.44,53.28 U12.P$44
DRAM_D10
  Top 0.203: U$5.66 88.94,48.35 90.63,50.04 90.63,53.27 U12.P$45
DRAM_D11
  Top 0.203: U$5.67 87.71,48.85 89.05,50.19 U12.P$47
DRAM_D12
  Top 0.203: U$5.68 87.55,49.35 88.29,50.09 88.29,53.27 U12.P$48
DRAM_D13  (via drill 0.2 pad 0.46)
  Top 0.203: U12.P$50 86.66,56.92 86.39,57.2 78.28,57.23 77.17,58.06 71.09,58.09 69.62,57.3 67.59,57.28 v66.95,57.84 | v66.98,55.63 66.8,55.63 65.71,54.53 65.71,53.37 U$5.77
  Bottom 0.203: v66.95,57.84 66.95,55.65 v66.98,55.63
DRAM_D14  (via drill 0.2 pad 0.46)
  Top 0.203: U$5.78 65.23,55.07 66.52,56.36 70.33,56.41 71.3,57.17 76.43,57.17 77.37,56.36 82.98,56.36 v83.52,55.83 | v85.85,55.78 U12.P$51
  Bottom 0.203: v83.52,55.83 85.8,55.83 v85.85,55.78
DRAM_D15
  Top 0.203: U12.P$53 84.26,56.4 83.84,56.82 77.85,56.82 76.94,57.66 71.32,57.66 70.08,56.84 66.02,56.82 64.72,55.52 64.72,53.35 U$5.79
DRAM_DQMH  (via drill 0.2 pad 0.46)
  Top 0.203: U12.P$39 95.46,49.66 v92.81,47.42 | v89.51,23.44 54.99,23.5 54.97,25.27 42.29,25.27 v42.01,24.92 | v41.25,34.82 48.21,34.82 U$5.142
  Bottom 0.203: v92.81,47.42 92.33,47.42 92.33,42.44 91.64,42.44 91.67,32.89 90.22,32.92 90.14,32.89 89.43,32.44 v89.51,23.44 | v42.01,24.92 41.2,34.77 v41.25,34.82
DRAM_DQML  (via drill 0.2 pad 0.46)
  Top 0.203: U12.P$15 94.66,43.58 v95.17,44.09 | v55.58,45.01 55.55,38.81 52.07,35.33 48.24,35.33 U$5.141
  Route2 0.203: v95.17,44.09 94.72,44.09 93.17,45.64 92.71,45.64 90.17,48.18 72.87,48.18 70.81,46.13 55.98,46.13 v55.58,45.01
DRAM_RAS  (via drill 0.2 pad 0.46)
  Top 0.203: U12.P$18 97.06,39.11 v97.43,38.73 | v73.58,39.67 73.53,39.67 73.53,39.85 U$5.49
  Route2 0.203: v97.43,38.73 74.73,38.73 v73.58,39.67
DRAM_WE  (via drill 0.2 pad 0.46)
  Top 0.203: U12.P$16 95.46,37.85 v95.3,37.64 | v72.44,36.83 69.75,36.83 U$5.43
  Route2 0.203: v95.3,37.64 94.51,37.64 94.54,37.82 73.38,37.82 v72.44,36.83
DVDD_REF
  Top 0.203: J2.P10 29.92,45.61 29.16,44.86 28.27,44.86 25.65,42.24 23.1,41.96 C92.2
FLIR_1V2  (via drill 0.2 pad 0.46)
  Top 0.406: IC7.5 5.63,17.09 C43.1 5.55,18.87 C70.1 5.34,20.61 5.08,21.44 4.67,21.97 v4.7,22.1 | v11.35,25.91 11.35,24.86 IR1.P$7
  Bottom 0.406: v4.7,22.1 4.62,22.07 4.8,22.07 4.8,23.37 9.68,24.28 9.73,25.32 v11.35,25.91
FLIR_2V8  (via drill 0.2 pad 0.46)
  Top 0.406: IC10.5 1.46,17.04 C67.1 1.36,18.64 C68.1 | C68.1 1.17,18.75 | C68.1 1.35,18.75 1.57,19.91 2.87,21.08 3.3,21.77 v3.48,22.2 | IR1.P$19 10.44,32.46 v10.46,32.44
  Bottom 0.406: v3.48,22.2 3.5,22.2 3.5,23.95 10.16,32.13 v10.46,32.44
FLIR_3V1  (via drill 0.2 pad 0.46)
  Top 0.203: v15.01,38.96 15.88,38.53 15.88,36.91 14.91,34.29 13.82,33.83 13.82,33.71 v13.28,33.17
  Top 0.406: IC8.5 14.78,18.58 C46.1 16.53,18.83 C69.1 16.83,18.58 v17.63,24.79 | v13.28,33.17 13.28,32.33 13.21,32.28 13.38,32.28 IR1.P$16
  Bottom 0.203: R68.P$1 13.56,40.92 R67.P$1 14.53,40.51 v15.01,38.96
  Bottom 0.406: v17.63,24.79 17.63,31.75 16.13,33.22 13.97,32.26 v13.28,33.17
FLIR_PWRC  (via drill 0.2 pad 0.46)
  Top 0.203: IC10.3 3.36,13.09 4.12,13.84 v4.19,13.84 7.14,13.84 | 7.14,13.84 7.19,13.79 7.24,13.79 7.39,13.64 | 7.39,13.64 7.39,12.76 IC7.3 | IC8.3 11.27,15.36 13.82,15.45 | 7.39,13.64 7.59,13.84 7.14,13.84 | 13.82,15.45 17.54,16.63 17.83,16.94 17.83,20.52 23.67,20.55 23.65,22.1 28.4,25.45 39.8,25.45 40.11,26.24 51.03,26.24 v51.46,26.21 | v53.42,29.92 53.42,30.3 53.24,30.4 53.24,31.76 U$5.7 | v7.01,8.97 8.05,8.97 10.19,11.1 12.34,11.33 13.11,12.65 13.06,15.27 13.82,15.45
  Route2 0.203: v4.19,13.84 4.19,11.79 v7.01,8.97
  Bottom 0.203: v51.46,26.21 51.61,27.81 v53.42,29.92
FLIR_PWRDN  (via drill 0.2 pad 0.46)
  Top 0.203: IR1.P$23 6.84,32.2 v7.44,31.6 | v59.26,55.6 59.77,55.6 60.22,55.14 U$5.88
  Route2 0.203: v12.12,53.16 56.74,53.09 v59.26,55.6
  Bottom 0.203: v7.44,31.6 7.29,31.6 6.86,32.03 6.86,33.68 8.56,37.21 8.59,39.5 11.76,41.35 11.76,52.81 v12.12,53.16
FLIR_RESET  (via drill 0.2 pad 0.46)